# Altium project 2m_DBoard_TX.PrjPcb (part 1 of 2)
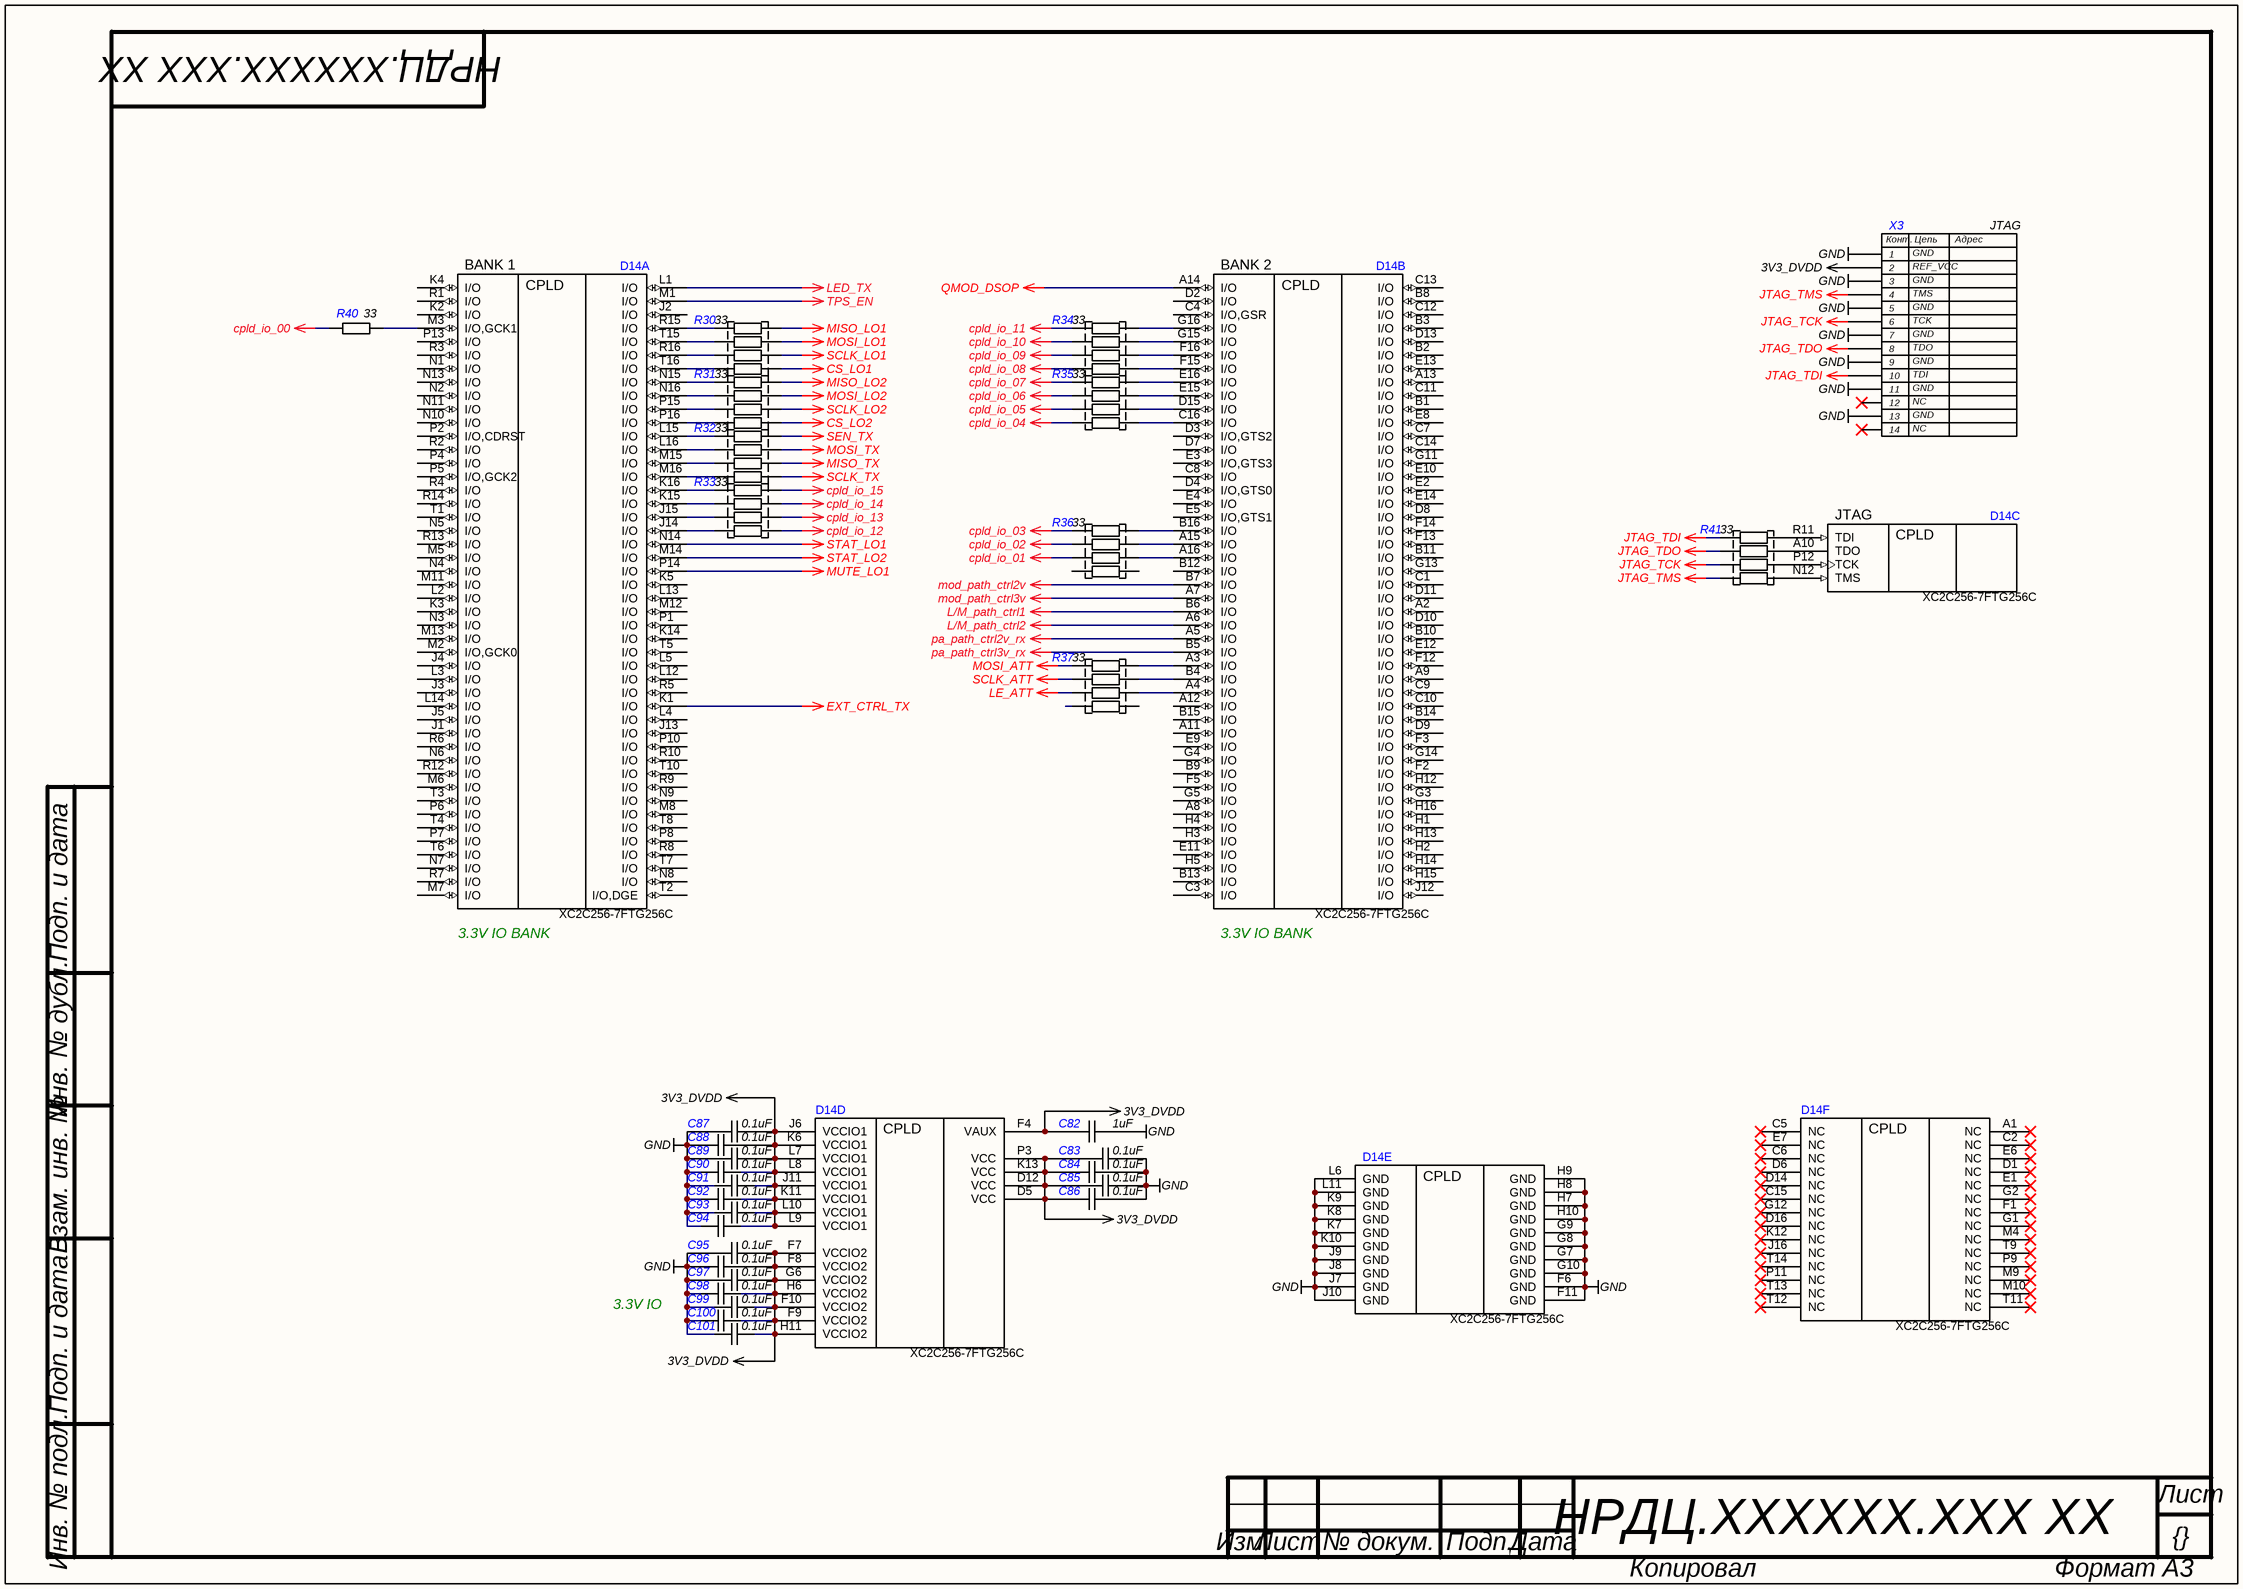
[diagram p0: CPLD.SchDoc]
7 sheets, 263 parts. Net scope: global (net labels, ports and power ports of the same name join across sheets).
Board file: 2m_DBoard_TX.PcbDoc
Sheets:
  CPLD.SchDoc
  DBoard_conn.SchDoc
  IF_TX.SchDoc
  TX.SchDoc
  REFCLK.SchDoc
  Digital.SchDoc
  Power.SchDoc

## Sheet CPLD.SchDoc: {Наименование}
size 420 x 297 mm; DocumentNumber: НРДЦ.ХХХХХХ.ХХХ ХХ; SheetNumber: {}; SheetTotal: {}; PageSetup: Record=PageOptions|CenterHorizontal=False|CenterVertical=False|PrintScale=0.95|XCorrection=0.00|YCorrection=0.00|PrintKind=1|BorderSize=5000000|LeftOffset=0|BottomOffset=0|Orientation=1|PaperLength=1000|PaperWidth=1000|Scale=100|PaperSource=15|PrintQuality=600|MediaType=1|DitherType=10|PaperKind=A4|PrintScaleMode=1; Rule: PcbType=ProtelPcb

### Parts
C82  value 1uF  [C0402]  (hidden comment: CAP)
C83  value 0.1uF  [C0402]  (hidden comment: CAP)
C84  value 0.1uF  [C0402]  (hidden comment: CAP)
C85  value 0.1uF  [C0402]  (hidden comment: CAP)
C86  value 0.1uF  [C0402]  (hidden comment: CAP)
C87  value 0.1uF  [C0402]  (hidden comment: CAP)
C88  value 0.1uF  [C0402]  (hidden comment: CAP)
C89  value 0.1uF  [C0402]  (hidden comment: CAP)
C90  value 0.1uF  [C0402]  (hidden comment: CAP)
C91  value 0.1uF  [C0402]  (hidden comment: CAP)
C92  value 0.1uF  [C0402]  (hidden comment: CAP)
C93  value 0.1uF  [C0402]  (hidden comment: CAP)
C94  value 0.1uF  [C0402]  (hidden comment: CAP)
C95  value 0.1uF  [C0402]  (hidden comment: CAP)
C96  value 0.1uF  [C0402]  (hidden comment: CAP)
C97  value 0.1uF  [C0402]  (hidden comment: CAP)
C98  value 0.1uF  [C0402]  (hidden comment: CAP)
C99  value 0.1uF  [C0402]  (hidden comment: CAP)
C100  value 0.1uF  [C0402]  (hidden comment: CAP)
C101  value 0.1uF  [C0402]  (hidden comment: CAP)
D14  XC2C256-7FTG256C  [FTG256]  (parts A,B,C,D,E,F of 6)
R30  value 33  [EXN8V]  (hidden comment: RES 4x0402)
R31  value 33  [EXN8V]  (hidden comment: RES 4x0402)
R32  value 33  [EXN8V]  (hidden comment: RES 4x0402)
R33  value 33  [EXN8V]  (hidden comment: RES 4x0402)
R34  value 33  [EXN8V]  (hidden comment: RES 4x0402)
R35  value 33  [EXN8V]  (hidden comment: RES 4x0402)
R36  value 33  [EXN8V]  (hidden comment: RES 4x0402)
R37  value 33  [EXN8V]  (hidden comment: RES 4x0402)
R40  value 33  [R0402]  (hidden comment: RES)
R41  value 33  [EXN8V]  (hidden comment: RES 4x0402)
X3  JTAG  [JTAG Mail 2mm]

### Nets
3V3_DVDD: C82.1 C83.1 C84.1 C85.1 C86.1 C87.2 C88.2 C89.2 C90.2 C91.2 C92.2 C93.2 C94.2 C95.2 C96.2 C97.2 C98.2 C99.2 C100.2 C101.2 D14.D5(VCC) D14.D12(VCC) D14.F4(VAUX) D14.F7(VCCIO2) D14.F8(VCCIO2) D14.F9(VCCIO2) D14.F10(VCCIO2) D14.G6(VCCIO2) D14.H6(VCCIO2) D14.H11(VCCIO2) D14.J6(VCCIO1) D14.J11(VCCIO1) D14.K6(VCCIO1) D14.K11(VCCIO1) D14.K13(VCC) D14.L7(VCCIO1) D14.L8(VCCIO1) D14.L9(VCCIO1) D14.L10(VCCIO1) D14.P3(VCC) X3.2
cpld_io_00: R40.2
cpld_io_01: R36.7
cpld_io_02: R36.6
cpld_io_03: R36.5
cpld_io_04: R35.8
cpld_io_05: R35.7
cpld_io_06: R35.6
cpld_io_07: R35.5
cpld_io_08: R34.8
cpld_io_09: R34.7
cpld_io_10: R34.6
cpld_io_11: R34.5
cpld_io_12: R33.8
cpld_io_13: R33.7
cpld_io_14: R33.6
cpld_io_15: R33.5
CS_LO1: R30.5
CS_LO2: R31.5
EXT_CTRL_TX: D14.K1(I/O)
GND: C82.2 C83.2 C84.2 C85.2 C86.2 C87.1 C88.1 C89.1 C90.1 C91.1 C92.1 C93.1 C94.1 C95.1 C96.1 C97.1 C98.1 C99.1 C100.1 C101.1 D14.F6(GND) D14.F11(GND) D14.G7(GND) D14.G8(GND) D14.G9(GND) D14.G10(GND) D14.H7(GND) D14.H8(GND) D14.H9(GND) D14.H10(GND) D14.J7(GND) D14.J8(GND) D14.J9(GND) D14.J10(GND) D14.K7(GND) D14.K8(GND) D14.K9(GND) D14.K10(GND) D14.L6(GND) D14.L11(GND) X3.1 X3.3 X3.5 X3.7 X3.9 X3.11 X3.13
JTAG_TCK: R41.6 X3.6
JTAG_TDI: R41.8 X3.10
JTAG_TDO: R41.7 X3.8
JTAG_TMS: R41.5 X3.4
L/M_path_ctrl1: D14.B6(I/O)
L/M_path_ctrl2: D14.A6(I/O)
LE_ATT: R37.6
LED_TX: D14.L1(I/O)
MISO_LO1: R30.8
MISO_LO2: R31.8
MISO_TX: R32.6
mod_path_ctrl2v: D14.B7(I/O)
mod_path_ctrl3v: D14.A7(I/O)
MOSI_ATT: R37.8
MOSI_LO1: R30.7
MOSI_LO2: R31.7
MOSI_TX: R32.7
MUTE_LO1: D14.P14(I/O)
pa_path_ctrl2v_rx: D14.A5(I/O)
pa_path_ctrl3v_rx: D14.B5(I/O)
QMOD_DSOP: D14.A14(I/O)
SCLK_ATT: R37.7
SCLK_LO1: R30.6
SCLK_LO2: R31.6
SCLK_TX: R32.5
SEN_TX: R32.8
STAT_LO1: D14.N14(I/O)
STAT_LO2: D14.M14(I/O)
TPS_EN: D14.M1(I/O)
NetD14_A3: D14.A3(I/O) R37.1
NetD14_A4: D14.A4(I/O) R37.3
NetD14_A10: D14.A10(TDO) R41.2
NetD14_A15: D14.A15(I/O) R36.3
NetD14_A16: D14.A16(I/O) R36.2
NetD14_B4: D14.B4(I/O) R37.2
NetD14_B16: D14.B16(I/O) R36.4
NetD14_C16: D14.C16(I/O) R35.1
NetD14_D15: D14.D15(I/O) R35.2
NetD14_E15: D14.E15(I/O) R35.3
NetD14_E16: D14.E16(I/O) R35.4
NetD14_F15: D14.F15(I/O) R34.1
NetD14_F16: D14.F16(I/O) R34.2
NetD14_G15: D14.G15(I/O) R34.3
NetD14_G16: D14.G16(I/O) R34.4
NetD14_J14: D14.J14(I/O) R33.1
NetD14_J15: D14.J15(I/O) R33.2
NetD14_K15: D14.K15(I/O) R33.3
NetD14_K16: D14.K16(I/O) R33.4
NetD14_L15: D14.L15(I/O) R32.1
NetD14_L16: D14.L16(I/O) R32.2
NetD14_M3: D14.M3(I/O,GCK1) R40.1
NetD14_M15: D14.M15(I/O) R32.3
NetD14_M16: D14.M16(I/O) R32.4
NetD14_N12: D14.N12(TMS) R41.4
NetD14_N15: D14.N15(I/O) R31.1
NetD14_N16: D14.N16(I/O) R31.2
NetD14_P12: D14.P12(TCK) R41.3
NetD14_P15: D14.P15(I/O) R31.3
NetD14_P16: D14.P16(I/O) R31.4
NetD14_R11: D14.R11(TDI) R41.1
NetD14_R15: D14.R15(I/O) R30.1
NetD14_R16: D14.R16(I/O) R30.2
NetD14_T15: D14.T15(I/O) R30.3
NetD14_T16: D14.T16(I/O) R30.4

Not connected (* = marked no-connect by the designer): D14 A1(NC)* A2(I/O) A8(I/O) A9(I/O) A11(I/O) A12(I/O) A13(I/O) B1(I/O) B2(I/O) B3(I/O) B8(I/O) B9(I/O) B10(I/O) B11(I/O) B12(I/O) B13(I/O) B14(I/O) B15(I/O) C1(I/O) C2(NC)* C3(I/O) C4(I/O,GSR) C5(NC)* C6(NC)* C7(I/O) C8(I/O) C9(I/O) C10(I/O) C11(I/O) C12(I/O) C13(I/O) C14(I/O) C15(NC)* D1(NC)* D2(I/O) D3(I/O,GTS2) D4(I/O,GTS0) D6(NC)* D7(I/O) D8(I/O) D9(I/O) D10(I/O) D11(I/O) D13(I/O) D14(NC)* D16(NC)* E1(NC)* E2(I/O) E3(I/O,GTS3) E4(I/O) E5(I/O,GTS1) E6(NC)* E7(NC)* E8(I/O) E9(I/O) E10(I/O) E11(I/O) E12(I/O) E13(I/O) E14(I/O) F1(NC)* F2(I/O) F3(I/O) F5(I/O) F12(I/O) F13(I/O) F14(I/O) G1(NC)* G2(NC)* G3(I/O) G4(I/O) G5(I/O) G11(I/O) G12(NC)* G13(I/O) G14(I/O) H1(I/O) H2(I/O) H3(I/O) H4(I/O) H5(I/O) H12(I/O) H13(I/O) H14(I/O) H15(I/O) H16(I/O) J1(I/O) J2(I/O) J3(I/O) J4(I/O) J5(I/O) J12(I/O) J13(I/O) J16(NC)* K2(I/O) K3(I/O) K4(I/O) K5(I/O) K12(NC)* K14(I/O) L2(I/O) L3(I/O) L4(I/O) L5(I/O) L12(I/O) L13(I/O) L14(I/O) M2(I/O,GCK0) M4(NC)* M5(I/O) M6(I/O) M7(I/O) M8(I/O) M9(NC)* M10(NC)* M11(I/O) M12(I/O) M13(I/O) N1(I/O) N2(I/O) N3(I/O) N4(I/O) N5(I/O) N6(I/O) N7(I/O) N8(I/O) N9(I/O) N10(I/O) N11(I/O) N13(I/O) P1(I/O) P2(I/O,CDRST) P4(I/O) P5(I/O,GCK2) P6(I/O) P7(I/O) P8(I/O) P9(NC)* P10(I/O) P11(NC)* P13(I/O) R1(I/O) R2(I/O) R3(I/O) R4(I/O) R5(I/O) R6(I/O) R7(I/O) R8(I/O) R9(I/O) R10(I/O) R12(I/O) R13(I/O) R14(I/O) T1(I/O) T2(I/O,DGE) T3(I/O) T4(I/O) T5(I/O) T6(I/O) T7(I/O) T8(I/O) T9(NC)* T10(I/O) T11(NC)* T12(NC)* T13(NC)* T14(NC)*; R36 1 8; R37 4 5; X3 12* 14*

### Notes on the sheet
- (near X3) GND
- (near X3) REF_VCC
- (near X3) TMS
- (near X3) TCK
- (near X3) TDO
- (near X3) TDI
- (near X3) NC
- (near D14) 3.3V IO BANK
- 3.3V IO
- Подп. и дата
- Инв. № дубл.
- Взам. инв. №
- Инв. № подл.
- Лист
- Изм.
- № докум.
- Подп.
- Дата
- Копировал
- Формат А3
- (in symbol HDR Debug_14-pin) Конт.; Цепь; Адрес
- (in symbol XC2C256-7FTG256C, part A) BANK 1
- (in symbol XC2C256-7FTG256C, part B) BANK 2
- (in symbol XC2C256-7FTG256C, part C) JTAG

### Library data of the parts
C82 = CAP: SMD Capacitor; Manufacturer: Murata; Material: X7R; Tolerance: 10%; Voltage: 6.3V; Type: Ceramic Capacitor; P/N: GRM155R70J105KA12J; Supplier 1: Digi-key; Supplier Part Number 1: 490-13339-1-ND; Supplier 2: Mouser; Supplier Part Number 2: 81-GRM155R70J105KA2J; Supplier 3: Farnell; Supplier Part Number 3: *
C83-C101 = CAP: SMD Capacitor; Manufacturer: Murata; Material: X7R; Tolerance: 10%; Voltage: 10V; Type: Ceramic Capacitor; P/N: GRM155R71A104KA01J; Supplier 1: Digi-key; Supplier Part Number 1: 490-6322-1-ND; Supplier 2: Mouser; Supplier Part Number 2: 81-GRM155R71A104KA1J; Supplier 3: Farnell; Supplier Part Number 3: *
D14 = XC2C256-7FTG256C: CoolRunner-II 1.8V, 256 Macrocell CPLD, 184 User I/Os, 256-Ball FTBGA, Commercial Grade, Pb-Free; Code_JEDEC: MS-034-AAF-1*; PackageVersion: ver1.3, Oct-2007; PackageReference: FTG256; PackageDescription: 256-Ball Fine Pitch Thin Ball Grid Array 1.00 mm Pitch (FTG256) - Pb-Free; DatasheetVersion: ver3.2, Mar-2007; PartNumber: XC2C256-7FTG256C; P/N: XC2C256-7FTG256C; Name: XC2C256-7FTG256C; Type: CPLD; Supplier 1: Digi-key; Supplier Part Number 1: 122-1400-ND; Supplier 2: Mouser; Supplier Part Number 2: 217-XC2C256-7FTG256C; Supplier 3: Farnell; Supplier Part Number 3: *
R30-R37 R41 = RES 4x0402: Chip Resistor Array; Manufacturer: Panasonic; Name: EXBN8V; Number of Resistors: 4; Tolerance: 5%; P/N: ERJ-2GEJ330X; Type: 0402 Array Concave Terminal; Number of Terminals: 8; Series: EXB; Supplier 1: Digi-key; Supplier Part Number 1: Y10330CT-ND; Supplier 2: Mouser; Supplier Part Number 2: 667-EXB-N8V330JX; Supplier 3: Farnell; Supplier Part Number 3: *; Supplier 4: Digi-key; Supplier Part Number 4: *; Supplier 5: Mouser; Supplier Part Number 5: *; Supplier 6: Farnell; Supplier Part Number 6: *
R40 = RES: SMD Resistor; Name: Chip SMD Resistor; Power: 0.1 Wt; Tolerance: 1%; P/N: ERJ-2RKF33R0X; Temperature Range: -55…155°C; Supplier 1: Digi-key; Supplier Part Number 1: P33.0LCT-ND; Supplier 2: Mouser; Supplier Part Number 2: 667-ERJ-2RKF33R0X; Supplier 3: Farnell; Supplier Part Number 3: *
X3 = HDR Debug_14-pin: 2.00mm Pitch, Milli-Grid PCB Header, Dual Row, Vertical, Through Hole, Shrouded, 14 / Circuits; Manufacturer: Molex; Name: Milli-Grid Connector System; P/N: 878311421; Type: 2.00mm Pitch, Milli-Grid PCB Header, Dual Row, Vertical, Through Hole, Shrouded, 14; Series: 87831; Supplier 1: Digi-key; Supplier Part Number 1: WM4224-ND; Supplier 2: Mouser; Supplier Part Number 2: 538-87831-1421; Supplier 3: Farnell; Supplier Part Number 3: *

## Sheet DBoard_conn.SchDoc: {Наименование}
size 420 x 297 mm; DocumentNumber: ПЛАС.ХХХХХХ.ХХХ ХХ; SheetNumber: {}; SheetTotal: {}; PageSetup: Record=PageOptions|CenterHorizontal=False|CenterVertical=False|PrintScale=0.95|XCorrection=0.00|YCorrection=0.00|PrintKind=1|BorderSize=5000000|LeftOffset=0|BottomOffset=0|Orientation=1|PaperLength=1000|PaperWidth=1000|Scale=100|PaperSource=15|PrintQuality=600|MediaType=1|DitherType=10|PaperKind=A4|PrintScaleMode=1; Rule: PcbType=ProtelPcb
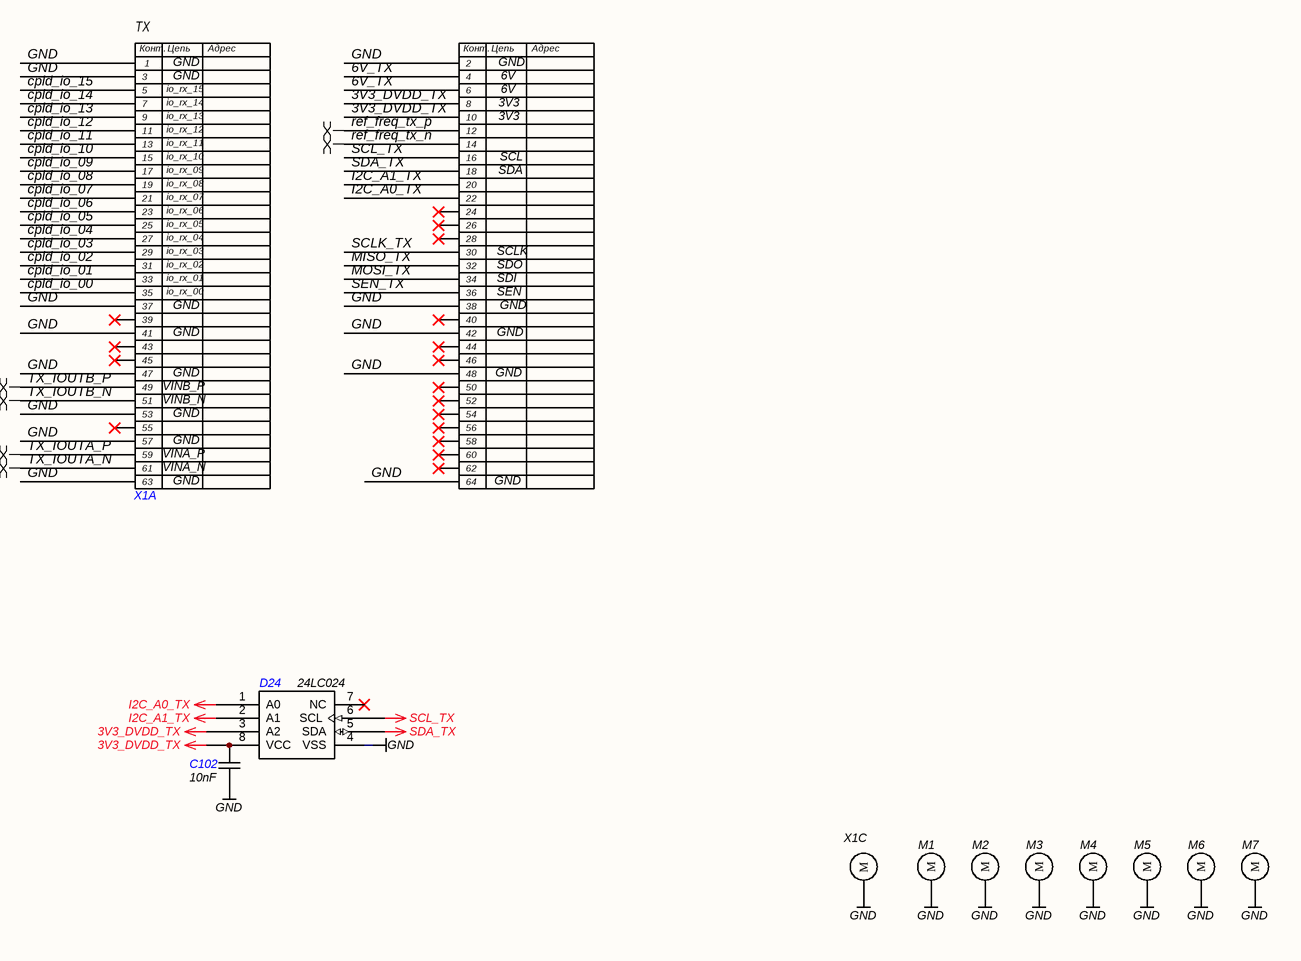
[diagram p1: DBoard_conn.SchDoc]

### Parts
C102  value 10nF  [C0402]  (hidden comment: CAP)
D24  24LC024  [SOIC_SN8]
M1  Via  [Mechanical_Via_2.6x4.2]  (value not drawn)
M2  Via  [Mechanical_Via_2.6x4.2]  (value not drawn)
M3  Via  [Mechanical_Via_2.6x4.2]  (value not drawn)
M4  Via  [Mechanical_Via_2.6x4.2]  (value not drawn)
M5  Via  [Mechanical_Via_2.6x4.2]  (value not drawn)
M6  Via  [Mechanical_Via_2.6x4.2]  (value not drawn)
M7  Via  [Mechanical_Via_2.6x4.2]  (value not drawn)
X1  DBoard  [DBOARD-HALF-TX-MB]  (value not drawn)  (parts A,C of 3)

### Nets
3V3_DVDD_TX: C102.2 D24.3(A2) D24.8(VCC) X1.8 X1.10
6V_TX: X1.4 X1.6
cpld_io_00: X1.35
cpld_io_01: X1.33
cpld_io_02: X1.31
cpld_io_03: X1.29
cpld_io_04: X1.27
cpld_io_05: X1.25
cpld_io_06: X1.23
cpld_io_07: X1.21
cpld_io_08: X1.19
cpld_io_09: X1.17
cpld_io_10: X1.15
cpld_io_11: X1.13
cpld_io_12: X1.11
cpld_io_13: X1.9
cpld_io_14: X1.7
cpld_io_15: X1.5
GND: C102.1 D24.4(VSS) M1.0(M) M2.0(M) M3.0(M) M4.0(M) M5.0(M) M6.0(M) M7.0(M) X1.0(M) X1.1 X1.2 X1.3 X1.37 X1.38 X1.41 X1.42 X1.47 X1.48 X1.53 X1.57 X1.63 X1.64
I2C_A0_TX: D24.1(A0) X1.22
I2C_A1_TX: D24.2(A1) X1.20
MISO_TX: X1.32
MOSI_TX: X1.34
ref_freq_tx_n: X1.14
ref_freq_tx_p: X1.12
SCL_TX: D24.6(SCL) X1.16
SCLK_TX: X1.30
SDA_TX: D24.5(SDA) X1.18
SEN_TX: X1.36
TX_IOUTA_N: X1.61
TX_IOUTA_P: X1.59
TX_IOUTB_N: X1.51
TX_IOUTB_P: X1.49

Not connected (* = marked no-connect by the designer): D24 7(NC)*; X1 24* 26* 28* 39* 40* 43* 44* 45* 46* 50* 52* 54* 55* 56* 58* 60* 62*

### Layout directives
differential pair: ref_freq_tx_n, ref_freq_tx_p, TX_IOUTA_N, TX_IOUTA_P, TX_IOUTB_N, TX_IOUTB_P

### Notes on the sheet
- (near X1) io_rx_15
- (near X1) io_rx_14
- (near X1) GND
- (near X1) 3V3
- (near X1) 6V
- (near X1) io_rx_13
- (near X1) io_rx_12
- (near X1) io_rx_11
- (near X1) io_rx_10
- (near X1) io_rx_09
- (near X1) SDA
- (near X1) SCL
- (near X1) io_rx_08
- (near X1) io_rx_07
- (near X1) io_rx_06
- (near X1) io_rx_05
- (near X1) io_rx_04
- (near X1) io_rx_03
- (near X1) io_rx_02
- (near X1) io_rx_01
- (near X1) io_rx_00
- (near X1) SCLK
- (near X1) SDO
- (near X1) SDI
- (near X1) SEN
- (near X1) VINB_P
- (near X1) VINB_N
- (near X1) VINA_P
- (near X1) VINA_N
- Подп. и дата
- Инв. № дубл.
- Взам. инв. №
- Инв. № подл.
- Лист
- Изм.
- № докум.
- Подп.
- Дата
- Копировал
- Формат А3
- (in symbol DBoard, part A) TX; Конт.; Цепь; Адрес

### Library data of the parts
C102 = CAP: SMD Capacitor; Manufacturer: Murata; Material: X7R; Tolerance: 10%; Voltage: 25V; Type: Ceramic Capacitor; P/N: GRM155R71E103KA01D; Supplier 1: Digi-key; Supplier Part Number 1: 490-1312-1-ND; Supplier 2: Mouser; Supplier Part Number 2: 81-GRM36X103K25; Supplier 3: Farnell; Supplier Part Number 3: *
D24 = 24LC024: I2C EEPROM; Manufacturer: Microchip; Capacity: 2kbit; Max Clock: 400 kHz; Voltage: 2.5-5.5V; P/N: 24LC024HT-I/SN; Name: 24LC024; Package: SOIC-8; Type: I2C EEPROM; Value: 24LC024; Supplier 1: Digi-key; Supplier Part Number 1: 24LC024HT-I/SNCT-ND; Supplier 2: Mouser; Supplier Part Number 2: 579-24LC024HT-I/SN; Supplier 3: Farnell; Supplier Part Number 3: *
M1-M7 = Mechanical Via: Supplier 4: Digi-key; Supplier Part Number 4: *; Supplier 5: Mouser; Supplier Part Number 5: *; Supplier 6: Farnell; Supplier Part Number 6: *
X1 = DBoard: USRP DBoard; Manufacturer: Molex; Name: 1.00mm Pitch Mezzanine 714390164; P/N: 714390164; Supplier 1: Digi-Key; Supplier Part Number 1: WM17201-ND; Supplier 2: Mouser; Supplier Part Number 2: 538-71439-0164; Supplier 3: Farnell; Supplier Part Number 3: *

## Sheet IF_TX.SchDoc: {Наименование}
size 420 x 297 mm; DocumentNumber: ПЛАС.ХХХХХХ.ХХХ ХХ; SheetNumber: {}; SheetTotal: {}; PageSetup: Record=PageOptions|CenterHorizontal=False|CenterVertical=False|PrintScale=0.95|XCorrection=0.00|YCorrection=0.00|PrintKind=1|BorderSize=5000000|LeftOffset=0|BottomOffset=0|Orientation=1|PaperLength=1000|PaperWidth=1000|Scale=100|PaperSource=15|PrintQuality=600|MediaType=1|DitherType=10|PaperKind=A4|PrintScaleMode=1; Rule: PcbType=ProtelPcb
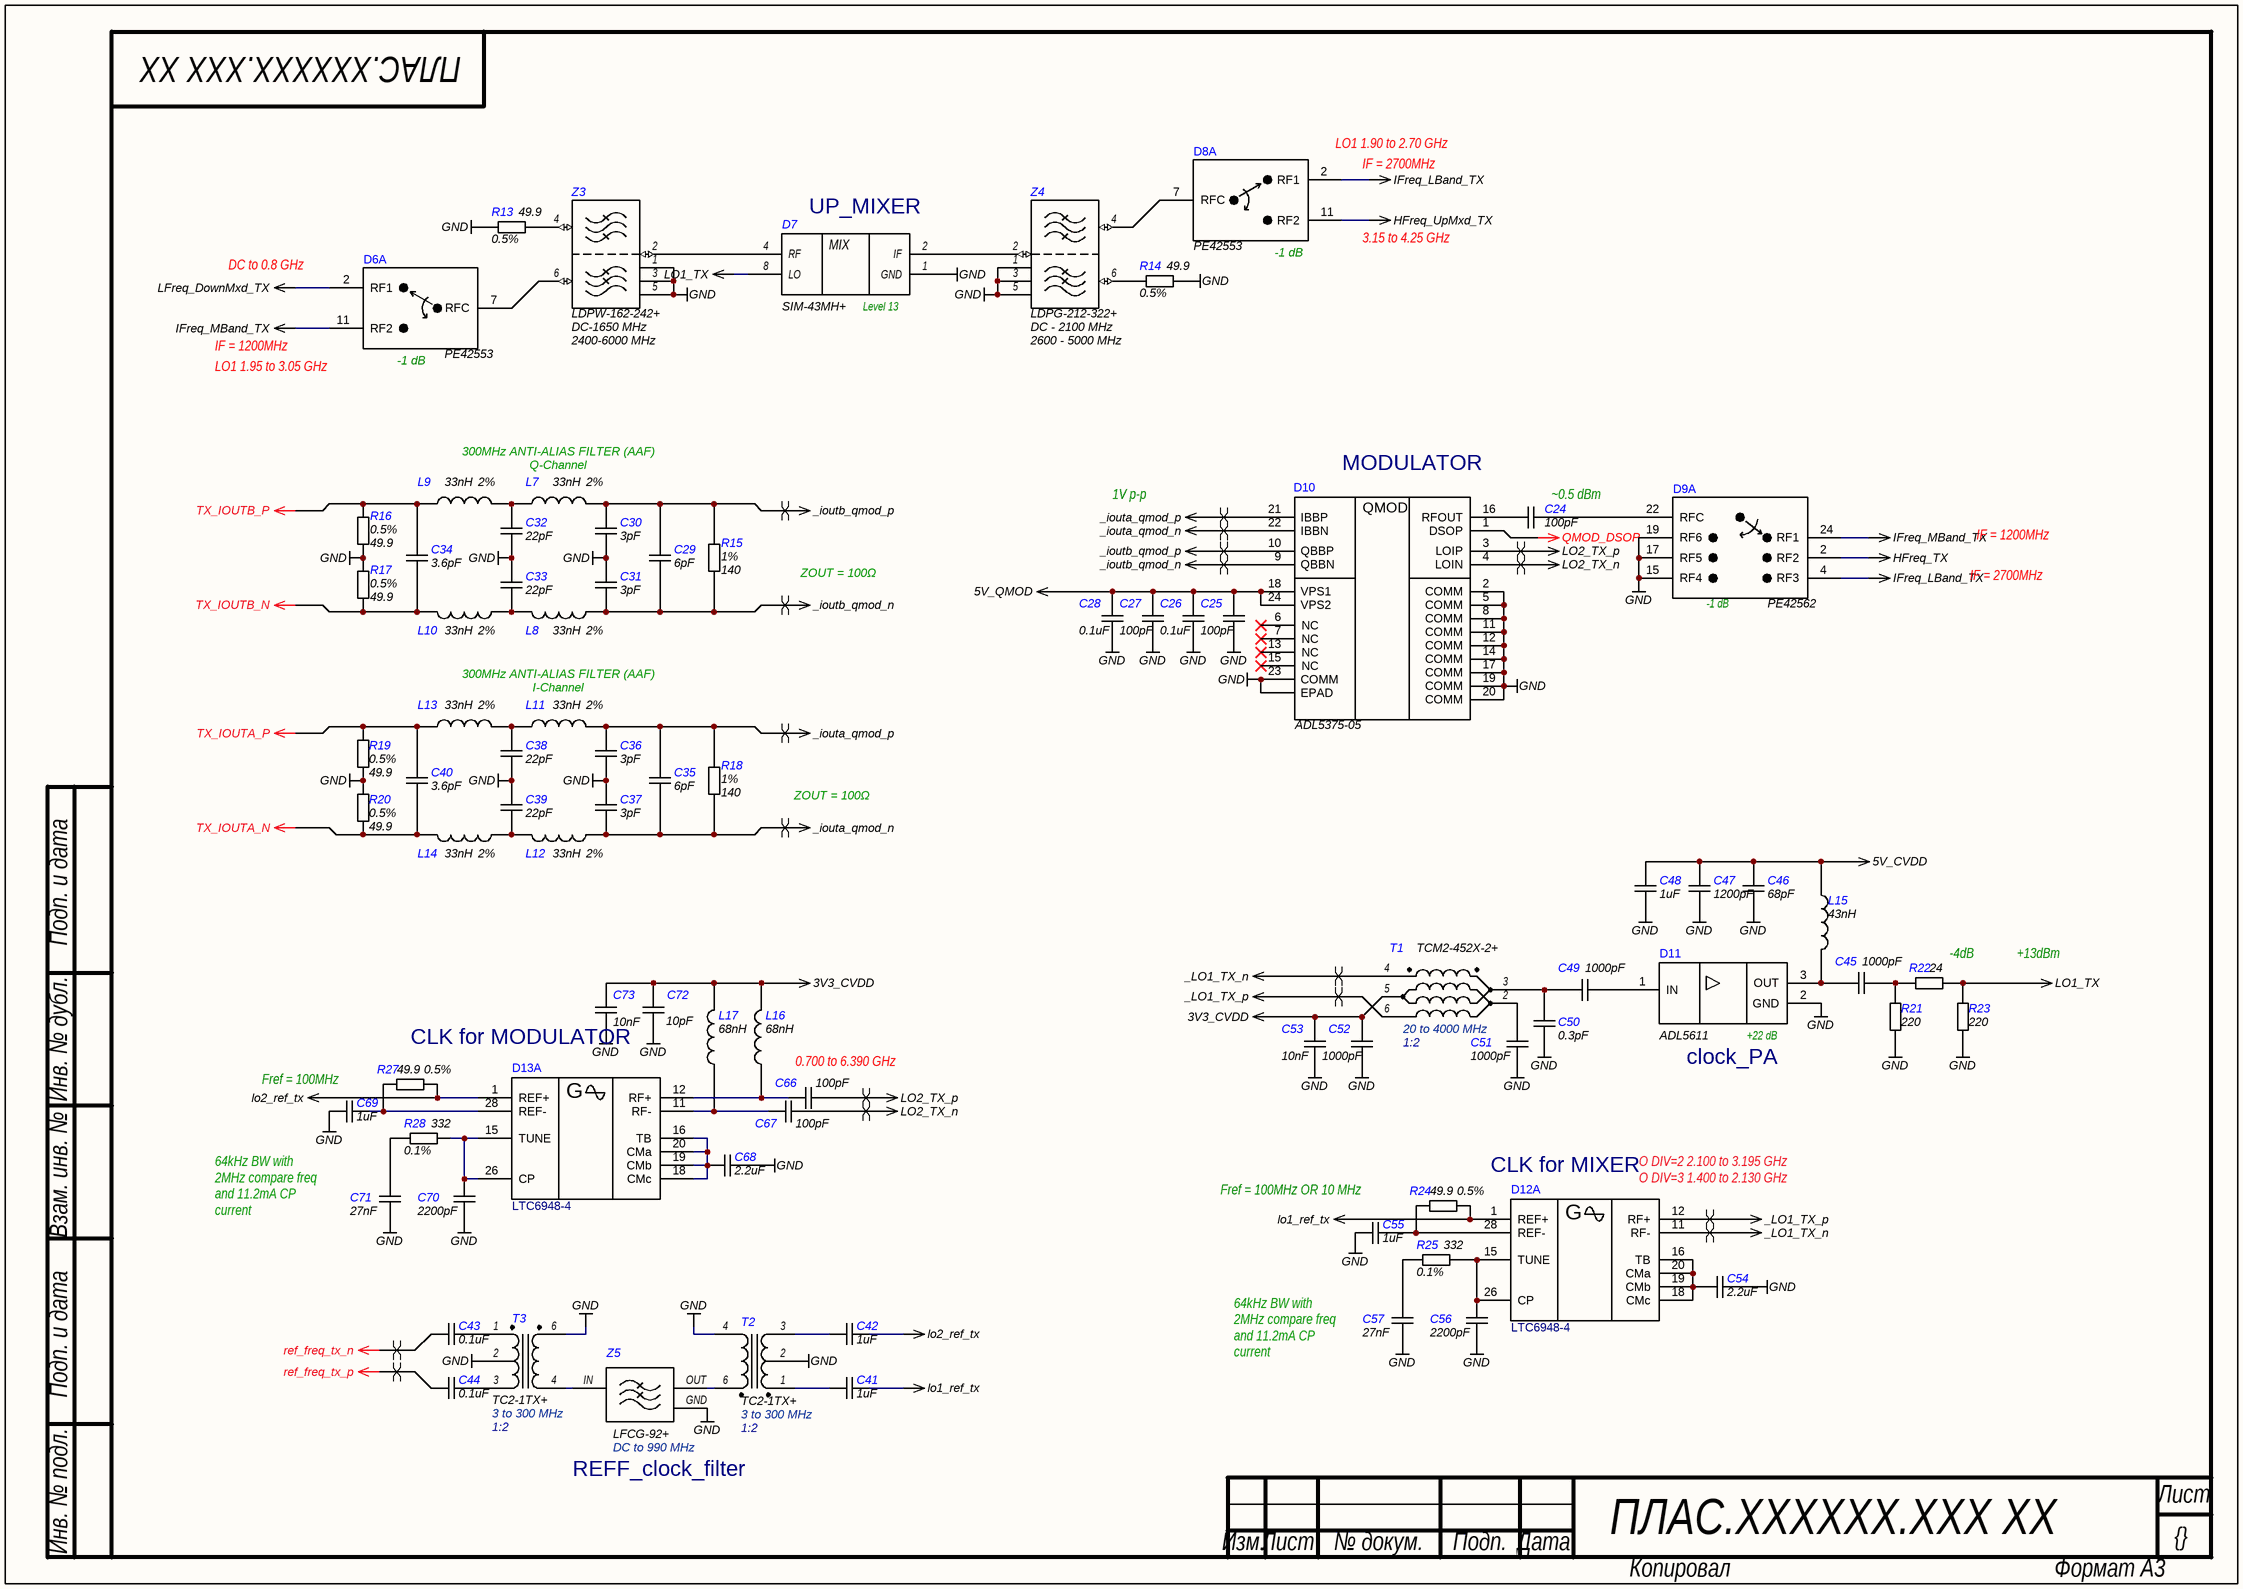
[diagram p2: IF_TX.SchDoc]

### Parts
C24  value 100pF  [C0402]  (hidden comment: CAP)
C25  value 100pF  [C0402]  (hidden comment: CAP)
C26  value 0.1uF  [C0402]  (hidden comment: CAP)
C27  value 100pF  [C0402]  (hidden comment: CAP)
C28  value 0.1uF  [C0402]  (hidden comment: CAP)
C29  value 6pF  [C0402]  (hidden comment: CAP)
C30  value 3pF  [C0402]  (hidden comment: CAP)
C31  value 3pF  [C0402]  (hidden comment: CAP)
C32  value 22pF  [C0402]  (hidden comment: CAP)
C33  value 22pF  [C0402]  (hidden comment: CAP)
C34  value 3.6pF  [C0402]  (hidden comment: CAP)
C35  value 6pF  [C0402]  (hidden comment: CAP)
C36  value 3pF  [C0402]  (hidden comment: CAP)
C37  value 3pF  [C0402]  (hidden comment: CAP)
C38  value 22pF  [C0402]  (hidden comment: CAP)
C39  value 22pF  [C0402]  (hidden comment: CAP)
C40  value 3.6pF  [C0402]  (hidden comment: CAP)
C41  value 1uF  [C0603]  (hidden comment: CAP)
C42  value 1uF  [C0603]  (hidden comment: CAP)
C43  value 0.1uF  [C0402]  (hidden comment: CAP)
C44  value 0.1uF  [C0402]  (hidden comment: CAP)
C45  value 1000pF  [C0402]  (hidden comment: CAP)
C46  value 68pF  [C0402]  (hidden comment: CAP)
C47  value 1200pF  [C0603]  (hidden comment: CAP)
C48  value 1uF  [C0603]  (hidden comment: CAP)
C49  value 1000pF  [C0402]  (hidden comment: CAP)
C50  value 0.3pF  [C0402]  (hidden comment: CAP)
C51  value 1000pF  [C0402]  (hidden comment: CAP)
C52  value 1000pF  [C0402]  (hidden comment: CAP)
C53  value 10nF  [C0402]  (hidden comment: CAP)
C54  value 2.2uF  [C0603]  (hidden comment: CAP)
C55  value 1uF  [C0603]  (hidden comment: CAP)
C56  value 2200pF  [C0603]  (hidden comment: CAP)
C57  value 27nF  [C0603]  (hidden comment: CAP)
C66  value 100pF  [C0402]  (hidden comment: CAP)
C67  value 100pF  [C0402]  (hidden comment: CAP)
C68  value 2.2uF  [C0603]  (hidden comment: CAP)
C69  value 1uF  [C0603]  (hidden comment: CAP)
C70  value 2200pF  [C0603]  (hidden comment: CAP)
C71  value 27nF  [C0603]  (hidden comment: CAP)
C72  value 10pF  [C0402]  (hidden comment: CAP)
C73  value 10nF  [C0402]  (hidden comment: CAP)
D6  PE42553  [QFN-16]  (part A of 2)
D7  SIM-43MH+  [SIM-43MH+]
D8  PE42553  [QFN-16]  (part A of 2)
D9  PE42562  [QFN-24]  (part A of 2)
D10  Name: ADL5375-05  [LFCSP-24]  (hidden comment: ADL5375)
D11  ADL5611  [ADL5610]
D12  LTC6948-4  [QFN-28]  (part A of 2)
D13  LTC6948-4  [QFN-28]  (part A of 2)
L7  value 33nH  Tolerance: 2%  [L0603_HP]  (hidden comment: Inductor RF)
L8  value 33nH  Tolerance: 2%  [L0603_HP]  (hidden comment: Inductor RF)
L9  value 33nH  Tolerance: 2%  [L0603_HP]  (hidden comment: Inductor RF)
L10  value 33nH  Tolerance: 2%  [L0603_HP]  (hidden comment: Inductor RF)
L11  value 33nH  Tolerance: 2%  [L0603_HP]  (hidden comment: Inductor RF)
L12  value 33nH  Tolerance: 2%  [L0603_HP]  (hidden comment: Inductor RF)
L13  value 33nH  Tolerance: 2%  [L0603_HP]  (hidden comment: Inductor RF)
L14  value 33nH  Tolerance: 2%  [L0603_HP]  (hidden comment: Inductor RF)
L15  value 43nH  [L0603_HP]  (hidden comment: Inductor RF)
L16  value 68nH  [L0603_HP]  (hidden comment: Inductor RF)
L17  value 68nH  [L0603_HP]  (hidden comment: Inductor RF)
R13  value 49.9  Tolerance: 0.5%  [R0402]  (hidden comment: RES)
R14  value 49.9  Tolerance: 0.5%  [R0402]  (hidden comment: RES)
R15  value 140  Tolerance: 1%  [R0402]  (hidden comment: RES)
R16  value 49.9  Tolerance: 0.5%  [R0402]  (hidden comment: RES)
R17  value 49.9  Tolerance: 0.5%  [R0402]  (hidden comment: RES)
R18  value 140  Tolerance: 1%  [R0402]  (hidden comment: RES)
R19  value 49.9  Tolerance: 0.5%  [R0402]  (hidden comment: RES)
R20  value 49.9  Tolerance: 0.5%  [R0402]  (hidden comment: RES)
R21  value 220  [R0402]  (hidden comment: RES)
R22  value 24  [R0402]  (hidden comment: RES)
R23  value 220  [R0402]  (hidden comment: RES)
R24  value 49.9  Tolerance: 0.5%  [R0402]  (hidden comment: RES)
R25  value 332  Tolerance: 0.1%  [R0603]  (hidden comment: RES)
R27  value 49.9  Tolerance: 0.5%  [R0402]  (hidden comment: RES)
R28  value 332  Tolerance: 0.1%  [R0603]  (hidden comment: RES)
T1  TCM2-452X-2+  Frequency: 20 to 4000 MHz  Ratio: 1:2  [DB1627]
T2  TC2-1TX+  Frequency: 3 to 300 MHz  Ratio: 1:2  [AT1521]
T3  TC2-1TX+  Frequency: 3 to 300 MHz  Ratio: 1:2  [AT1521]
Z3  LDPW-162-242+  Low Pass: DC-1650 MHz  High Pass: 2400-6000 MHz  [JC0603C]
Z4  LDPG-212-322+  Low Pass: DC - 2100 MHz  High Pass: 2600 - 5000 MHz  [GE0805C-10]
Z5  LFCG-92+  Frequency: DC to 990 MHz  [GE0805C-2]

### Nets
3V3_CVDD: C52.1 C53.2 C72.2 C73.2 L16.2 L17.2 T1.5
5V_CVDD: C46.2 C47.2 C48.1 L15.2
5V_QMOD: C25.2 C26.2 C27.2 C28.2 D10.18(VPS1) D10.24(VPS2)
_iouta_qmod_n: C35.2 C37.2 D10.22(IBBN) L12.2 R18.2
_iouta_qmod_p: C35.1 C36.1 D10.21(IBBP) L11.2 R18.1
_ioutb_qmod_n: C29.2 C31.2 D10.9(QBBN) L8.2 R15.2
_ioutb_qmod_p: C29.1 C30.1 D10.10(QBBP) L7.2 R15.1
_LO1_TX_n: D12.11(RF-) T1.4
_LO1_TX_p: D12.12(RF+) T1.6
GND: C25.1 C26.1 C27.1 C28.1 C30.2 C31.1 C32.2 C33.1 C36.2 C37.1 C38.2 C39.1 C46.1 C47.1 C48.2 C50.1 C51.2 C52.2 C53.1 C54.1 C55.2 C56.1 C57.1 C68.1 C69.2 C70.1 C71.1 C72.1 C73.1 D7.1(GND) D9.15(RF4) D9.17(RF5) D9.19(RF6) D10.2(COMM) D10.5(COMM) D10.8(COMM) D10.11(COMM) D10.12(COMM) D10.14(COMM) D10.17(COMM) D10.19(COMM) D10.20(COMM) D10.23(COMM) D10.25(EPAD) D11.2(GND) R13.1 R14.1 R16.2 R17.1 R19.2 R20.1 R21.2 R23.2 T2.2 T2.4 T3.2 T3.6 Z3.1(GND) Z3.3(GND) Z3.5(GND) Z4.1(GND) Z4.3(GND) Z4.5(GND) Z5.GND
HFreq_TX: D9.2(RF2)
HFreq_UpMxd_TX: D8.11(RF2)
IFreq_LBand_TX: D8.2(RF1) D9.4(RF3)
IFreq_MBand_TX: D6.11(RF2) D9.24(RF1)
LFreq_DownMxd_TX: D6.2(RF1)
lo1_ref_tx: C41.1 D12.1(REF+) R24.1
LO1_TX: D7.8(LO) R22.1 R23.1
lo2_ref_tx: C42.1 D13.1(REF+) R27.1
LO2_TX_n: C67.2 D10.4(LOIN)
LO2_TX_p: C66.2 D10.3(LOIP)
QMOD_DSOP: D10.1(DSOP)
ref_freq_tx_n: C43.2
ref_freq_tx_p: C44.2
TX_IOUTA_N: C40.2 L14.1 R20.2
TX_IOUTA_P: C40.1 L13.1 R19.1
TX_IOUTB_N: C34.2 L10.1 R17.2
TX_IOUTB_P: C34.1 L9.1 R16.1
NetC24_1: C24.1 D10.16(RFOUT)
NetC24_2: C24.2 D9.22(RFC)
NetC32_1: C32.1 L7.1 L9.2
NetC33_2: C33.2 L8.1 L10.2
NetC38_1: C38.1 L11.1 L13.2
NetC39_2: C39.2 L12.1 L14.2
NetC41_2: C41.2 T2.1
NetC42_2: C42.2 T2.3
NetC43_1: C43.1 T3.1
NetC44_1: C44.1 T3.3
NetC45_1: C45.1 D11.3(OUT) L15.1
NetC45_2: C45.2 R21.1 R22.2
NetC49_1: C49.1 C50.2 T1.3
NetC49_2: C49.2 D11.1(IN)
NetC51_1: C51.1 T1.2
NetC54_2: C54.2 D12.16(TB) D12.18(CMc) D12.19(CMb) D12.20(CMa)
NetC55_1: C55.1 D12.28(REF-) R24.2
NetC56_2: C56.2 D12.15(TUNE) D12.26(CP) R25.1
NetC57_2: C57.2 R25.2
NetC66_1: C66.1 D13.12(RF+) L16.1
NetC67_1: C67.1 D13.11(RF-) L17.1
NetC68_2: C68.2 D13.16(TB) D13.18(CMc) D13.19(CMb) D13.20(CMa)
NetC69_1: C69.1 D13.28(REF-) R27.2
NetC70_2: C70.2 D13.15(TUNE) D13.26(CP) R28.1
NetC71_2: C71.2 R28.2
NetD6_7: D6.7(RFC) Z3.6
NetD7_2: D7.2(IF) Z4.2
NetD7_4: D7.4(RF) Z3.2
NetD8_7: D8.7(RFC) Z4.4
NetR13_2: R13.2 Z3.4
NetR14_2: R14.2 Z4.6
NetT2_6: T2.6 Z5.OUT
NetT3_4: T3.4 Z5.IN

Not connected (* = marked no-connect by the designer): D10 6(NC)* 7(NC)* 13(NC)* 15(NC)*

### Layout directives
differential pair: _iouta_qmod_n, _iouta_qmod_p, _ioutb_qmod_n, _ioutb_qmod_p, _LO1_TX_n, _LO1_TX_p, LO2_TX_n, LO2_TX_p, ref_freq_tx_n, ref_freq_tx_p

### Notes on the sheet
- (near D8) LO1 1.90 to 2.70 GHz
- IF = 2700MHz
- (near D7) UP_MIXER
- 3.15 to 4.25 GHz
- (near D6) DC to 0.8 GHz
- IF = 1200MHz
- (near D6) LO1 1.95 to 3.05 GHz
- 300MHz ANTI-ALIAS FILTER (AAF) Q-Channel
- 1V p-p
- (near D10) MODULATOR
- (near C24) ~0.5 dBm
- ZOUT = 100Ω
- 300MHz ANTI-ALIAS FILTER (AAF) I-Channel
- (near R22) -4dB
- +13dBm
- (near C73) CLK for MODULATOR
- 0.700 to 6.390 GHz
- (near D11) clock_PA
- (near C69) Fref = 100MHz
- Fref = 100MHz OR 10 MHz
- CLK for MIXER
- (near D12) O DIV=2 2.100 to 3.195 GHz
  O DIV=3 1.400 to 2.130 GHz
- 64kHz BW with 2MHz compare freq and 11.2mA CP current
- REFF_clock_filter
- Подп. и дата
- Инв. № дубл.
- Взам. инв. №
- Инв. № подл.
- Лист
- Изм.
- № докум.
- Подп.
- Дата
- Копировал
- Формат А3
- (in symbol ADL5375) QMOD
- (in symbol ADL5611) +22 dB
- (in symbol LTC6948, part A) G
- (in symbol PE42553, part A) -1 dB
- (in symbol PE42562, part A) -1 dB
- (in symbol SIM-43MH+) MIX; Level 13

### Library data of the parts
C24 C25 C27 C66 C67 = CAP: SMD Capacitor; Manufacturer: Murata; Material: NP0; Tolerance: 1%; Voltage: 50V; Type: Ceramic Capacitor; P/N: GRM1555C1H101FA01D; Supplier 1: Digi-key; Supplier Part Number 1: 490-8180-1-ND; Supplier 2: Mouser; Supplier Part Number 2: 81-GRM1555C1H101FA1D; Supplier 3: Farnell; Supplier Part Number 3: *
C26 C28 C43 C44 = CAP: as C83 on sheet CPLD; Supplier 1: Digi-key; Supplier Part Number 1: 490-6322-1-ND; Supplier 2: Mouser; Supplier Part Number 2: 81-GRM155R71A104KA1J; Supplier 3: Farnell; Supplier Part Number 3: *
C29 C35 = CAP: SMD Capacitor; Manufacturer: Murata; Material: NP0; Tolerance: ±0.5pF; Voltage: 50V; Type: Ceramic Capacitor; P/N: GRM1555C1H6R0DA01D; Supplier 1: Digi-key; Supplier Part Number 1: 490-5877-1-ND; Supplier 2: Mouser; Supplier Part Number 2: 81-GRM1555C1H6R0DA1D; Supplier 3: Farnell; Supplier Part Number 3: *
C30 C31 C36 C37 = CAP: SMD Capacitor; Manufacturer: Murata; Material: NP0; Tolerance: ±0.25pF; Voltage: 50V; Type: Ceramic Capacitor; P/N: GRM1555C1H3R0CA01D; Supplier 1: Digi-key; Supplier Part Number 1: 490-5872-1-ND; Supplier 2: Mouser; Supplier Part Number 2: 81-GRM1555C1H3R0CA1D; Supplier 3: Farnell; Supplier Part Number 3: *
C32 C33 C38 C39 = CAP: SMD Capacitor; Manufacturer: Murata; Material: NP0; Tolerance: 1%; Voltage: 50V; Type: Ceramic Capacitor; P/N: GRM1555C1H220FA01D; Supplier 1: Digi-key; Supplier Part Number 1: 490-8589-1-ND; Supplier 2: Mouser; Supplier Part Number 2: 81-GRM1555C1H220FA1D; Supplier 3: Farnell; Supplier Part Number 3: *
C34 C40 = CAP: SMD Capacitor; Manufacturer: Murata; Material: NP0; Tolerance: ±0.25pF; Voltage: 50V; Type: Ceramic Capacitor; P/N: GRM1555C1H3R6CA01D; Supplier 1: Digi-key; Supplier Part Number 1: 490-5939-1-ND; Supplier 2: Mouser; Supplier Part Number 2: 81-GRM1555C1H3R6CA1D; Supplier 3: Farnell; Supplier Part Number 3: *
C41 C42 C48 C55 C69 = CAP: SMD Capacitor; Manufacturer: Kemet; Material: X7R; Tolerance: 10%; Voltage: 16V; Type: Ceramic Capacitor; P/N: C0603C105K4RACTU; Supplier 1: Digi-key; Supplier Part Number 1: 399-C0603C105K4RAC7867CT-ND; Supplier 2: Mouser; Supplier Part Number 2: 80-C0603C105K4R; Supplier 3: Farnell; Supplier Part Number 3: *
C45 C49 C51 C52 = CAP: SMD Capacitor; Manufacturer: Murata; Material: NP0; Tolerance: 5%; Voltage: 50V; Type: Ceramic Capacitor; P/N: GRM1555C1H102JA01D; Supplier 1: Digi-key; Supplier Part Number 1: 490-3244-1-ND; Supplier 2: Mouser; Supplier Part Number 2: 81-GRM1555C1H102JA1D; Supplier 3: Farnell; Supplier Part Number 3: *
C46 = CAP: SMD Capacitor; Manufacturer: Murata; Material: NP0; Tolerance: ±1%; Voltage: 50V; Type: Ceramic Capacitor; P/N: GRM1555C1H680FA01D; Supplier 1: Digi-key; Supplier Part Number 1: 490-8219-1-ND; Supplier 2: Mouser; Supplier Part Number 2: 81-GRM1555C1H680FA1D; Supplier 3: Farnell; Supplier Part Number 3: *
C47 = CAP: SMD Capacitor; Manufacturer: Murata; Material: NP0; Tolerance: ±5%; Voltage: 50V; Type: Ceramic Capacitor; P/N: GRM1885C1H122JA01D; Supplier 1: Digi-key; Supplier Part Number 1: 490-1453-1-ND; Supplier 2: Mouser; Supplier Part Number 2: 81-GRM1885C1H122JA01; Supplier 3: Farnell; Supplier Part Number 3: *
C50 = CAP: SMD Capacitor; Manufacturer: Murata; Material: NP0; Tolerance: ±0.05pF; Voltage: 50V; Type: Ceramic Capacitor; P/N: GRM1555C1HR30WA01D; Supplier 1: Digi-key; Supplier Part Number 1: 490-6261-1-ND; Supplier 2: Mouser; Supplier Part Number 2: 81-GRM1555C1HR30WA1D; Supplier 3: Farnell; Supplier Part Number 3: *
C53 C73 = CAP: as C102 on sheet DBoard_conn; Supplier 1: Digi-key; Supplier Part Number 1: 490-1312-1-ND; Supplier 2: Mouser; Supplier Part Number 2: 81-GRM36X103K25; Supplier 3: Farnell; Supplier Part Number 3: *
C54 C68 = CAP: SMD Capacitor; Manufacturer: Murata; Material: X7R; Tolerance: 10%; Voltage: 10V; Type: Ceramic Capacitor; P/N: GRM188R71A225KE15J; Supplier 1: Digi-key; Supplier Part Number 1: 490-6418-1-ND; Supplier 2: Mouser; Supplier Part Number 2: 81-GRM188R71A225KE5J; Supplier 3: Farnell; Supplier Part Number 3: *
C56 C70 = CAP: SMD Capacitor; Manufacturer: Kemet; Material: NP0; Tolerance: 1%; Voltage: 50V; Type: Ceramic Capacitor; P/N: C0603C222F5GACTU; Supplier 1: Digi-key; Supplier Part Number 1: 399-14502-1-ND; Supplier 2: Mouser; Supplier Part Number 2: 80-C0603C222F5G; Supplier 3: Farnell; Supplier Part Number 3: *
C57 C71 = CAP: SMD Capacitor; Manufacturer: KYOCERA AVX; Material: X7R; Tolerance: ±5%; Voltage: 50V; Type: Ceramic Capacitor; P/N: 06035C273J4Z2A; Supplier 1: Digi-key; Supplier Part Number 1: 478-KAF15AR71H273JTCT-ND; Supplier 2: Mouser; Supplier Part Number 2: 581-06035C273J4Z2A; Supplier 3: Farnell; Supplier Part Number 3: *
C72 = CAP: SMD Capacitor; Manufacturer: Murata; Material: NP0; Tolerance: 1%; Voltage: 50V; Type: Ceramic Capacitor; P/N: GRM1555C1H100FA01D; Supplier 1: Digi-key; Supplier Part Number 1: 490-6186-1-ND; Supplier 2: Mouser; Supplier Part Number 2: 81-GRM1555C1H100FA1D; Supplier 3: Farnell; Supplier Part Number 3: *
D6 D8 = PE42553: HaRPTM technology-enhanced absorptive SPDT; Manufacturer: Peregrine Technical Solutions; P/N: PE42553A-Z; Type: SPDT RF Switch; Name: PE42553; Package: 16-lead 3 × 3 mm QFN; Supplier 1: Digi-Key; Supplier Part Number 1: 1046-1137-1-ND; Supplier 2: Mouser; Supplier Part Number 2: 81-PE42553B-Z; Supplier 3: Farnell; Supplier Part Number 3: *
D7 = SIM-43MH+: Frequency Mixer; Manufacturer: Mini-Circuits; Power Level: +13dBm; Name: SIM-43MH+; Package: HV1195; Type: Frequency Mixer; P/N: SIM-43MH+; Supplier 1: Digi-key; Supplier Part Number 1: *; Supplier 2: Mouser; Supplier Part Number 2: 139-SIM-43MH; Supplier 3: Minicircuits; Supplier Part Number 3: SIM-43MH+
D9 = PE42562: The PE42582 is a HaRP™ technology-enhanced absorptive SP6T RF switch; Manufacturer: Peregrine Technical Solutions; P/N: PE42562A-X; Name: PE42562; Package: 24-lead 4 × 4 × 0.85 mm QFN; Type: Absorptive SP6T RF switch; Supplier 1: Digi-key; Supplier Part Number 1: *; Supplier 2: Mouser; Supplier Part Number 2: 81-PE42562A-X; Supplier 3: Farnell; Supplier Part Number 3: *
D10 = ADL5375: Broadband Quadrature Modulator; Manufacturer: Analog Devices; Voltage: 4.75 V to 5.25 V; P/N: ADL5375-05SCPZEPR7; Package: 24-lead LFCSP_VQ package; Temperature Range: –40°C to 125°C; Type: Broadband Quadrature Modulator; Supplier 1: Digi-key; Supplier Part Number 1: ADL5375-05ACPZ-R7CT-ND; Supplier 2: Mouser; Supplier Part Number 2: 584-ADL5375-05ACPZR7; Supplier 3: Farnell; Supplier Part Number 3: *
D11 = ADL5611: RF/IF Gain Block; Manufacturer: Analog Devices; P/N: ADL5611ARKZ-R7; Name: ADL5611; Package: SOT89; Type: RF/IF Gain Block; Supplier 1: Digi-Key; Supplier Part Number 1: 505-ADL5611ARKZ-R7CT-ND; Supplier 2: Mouser; Supplier Part Number 2: 584-ADL5611ARKZ-R7; Supplier 3: Farnell; Supplier Part Number 3: *
D12 D13 = LTC6948: The LTC®LTC6948 is a high performance, low noise, 6.39GHz  phase-locked loop (PLL); Manufacturer: Linear Technology; Voltage: 3.15 V ~ 5.25 V; Type: Clock/Frequency Synthesizer (RF/IF), Integer N; P/N: LTC6948IUFD-4; Package: 28-QFN (4x5); Temperature Range: -40°C ~ 105°C; Supplier 1: Digi-Key; Supplier Part Number 1: 505-LTC6948IUFD-4#PBF-ND; Name: LTC6948-4; Supplier 2: Mouser; Supplier Part Number 2: 584-LTC6948IUFD-4PBF; Supplier 3: Farnell; Supplier Part Number 3: *
L7-L14 = Inductor RF: Chip SMD Inductor; Manufacturer: Coilcraft; Current: 680mA; Frequency: 2.70GHz; Name: 0603HP-33NXGE; Series: 0603HP; Temperature Range: -25…85°C; P/N: 0603HP-33NXGE; Supplier 1: Digi-key; Supplier Part Number 1: *; Supplier 2: Mouser; Supplier Part Number 2: 994-0603HP-33NXGLW; Supplier 3: Farnell; Supplier Part Number 3: 2286156
L15 = Inductor RF: Chip SMD Inductor; Manufacturer: Coilcraft; Current: 810mA; Frequency: 2.45GHz; Name: 0603HP-43NXJE; Tolerance: 5%; Series: 0603HP; Temperature Range: -25…85°C; P/N: 0603HP-43NXJE; Supplier 1: Digi-key; Supplier Part Number 1: *; Supplier 2: Mouser; Supplier Part Number 2: 994-0603HP-43NXJLW; Supplier 3: Farnell; Supplier Part Number 3: *
L16 L17 = Inductor RF: Chip SMD Inductor; Manufacturer: Coilcraft; Current: 600mA; Frequency: 2.00GHz; Name: 0603HP-68NXJE; Tolerance: 5%; Series: 0603HP; Temperature Range: -25…85°C; P/N: 0603HP-68NXJE; Supplier 1: Digi-key; Supplier Part Number 1: *; Supplier 2: Mouser; Supplier Part Number 2: 994-0603HP-68NXJLW; Supplier 3: Farnell; Supplier Part Number 3: 2286224
R13 R14 R16 R17 R19 R20 R24 R27 = RES: SMD Resistor; Manufacturer: Panasonic Electronic Components; Name: Chip SMD Resistor; Power: 0.063 Wt; P/N: ERJ-2RKD49R9X; Temperature Range: -55…155°C; Supplier 1: Digi-key; Supplier Part Number 1: P15987CT-ND; Supplier 2: Mouser; Supplier Part Number 2: 667-ERJ-2RKD49R9X; Supplier 3: Farnell; Supplier Part Number 3: *
R15 R18 = RES: SMD Resistor; Manufacturer: Panasonic Electronic Components; Name: Chip SMD Resistor; Power: 0.1 Wt; P/N: ERJ-2RKF1400X; Temperature Range: -55…155°C; Supplier 1: Digi-key; Supplier Part Number 1: P140LCT-ND; Supplier 2: Mouser; Supplier Part Number 2: 667-ERJ-2RKF1400X; Supplier 3: Farnell; Supplier Part Number 3: *
R21 R23 = RES: SMD Resistor; Manufacturer: Panasonic Electronic Components; Name: Chip SMD Resistor; Power: 0.1 Wt; Tolerance: ±1%; P/N: ERJ-2RKF2200X; Temperature Range: -55…155°C; Supplier 1: Digi-key; Supplier Part Number 1: *; Supplier 2: Mouser; Supplier Part Number 2: 667-ERJ-2RKF2200X; Supplier 3: Farnell; Supplier Part Number 3: 2302563
R22 = RES: SMD Resistor; Manufacturer: Vishay; Name: Chip SMD Resistor; Power: 0.063 Wt; Tolerance: ±1%; P/N: CRCW040224R0FKED; Temperature Range: -55…155°C; Supplier 1: Digi-key; Supplier Part Number 1: 541-24.0LCT-ND; Supplier 2: Mouser; Supplier Part Number 2: 71-CRCW040224R0FKED; Supplier 3: Farnell; Supplier Part Number 3: *
R25 R28 = RES: SMD Resistor; Manufacturer: Panasonic Electronic Components; Name: Chip SMD Resistor; Power: 0.1 Wt; P/N: ERA-3AEB3320V; Temperature Range: -55…155°C; Supplier 1: Digi-key; Supplier Part Number 1: P332DBCT-ND; Supplier 2: Mouser; Supplier Part Number 2: 667-ERA-3AEB3320V; Supplier 3: Farnell; Supplier Part Number 3: *
T1 = TCM2-452X-2+: RF Transformer; Manufacturer: Mini-Circuits; Name: TCM2-452X-2+; P/N: TCM2-452X-2+; Type: RF Transformer; Package: DB1627; Supplier 1: Digi-key; Supplier Part Number 1: *; Supplier 2: Mouser; Supplier Part Number 2: *; Supplier 3: Minicircuits; Supplier Part Number 3: TCM2-452X-2+
T2 T3 = TC2-1TX+: RF Transformer; Manufacturer: Mini-Circuits; Name: TC2-1TX+; P/N: TC2-1TX+; Type: RF Transformer; Package: AT1521; Supplier 1: Digi-key; Supplier Part Number 1: 3157-TC2-1TX+CT-ND; Supplier 2: Mouser; Supplier Part Number 2: 139-TC2-1TX; Supplier 3: Farnell; Supplier Part Number 3: *
Z3 = LDPW-162-242+: Diplexer; Manufacturer: Mini-Circuits; Frequency: DC to 6000 MHz; Name: LDPW-162-242+; P/N: LDPW-162-242+; Type: Diplexer; Package: JC0603C; Supplier 1: Digi-key; Supplier Part Number 1: 3157-LDPW-162-242+CT-ND; Supplier 2: Mouser; Supplier Part Number 2: 139-LDPW-162-242; Supplier 3: Farnell; Supplier Part Number 3: *
Z4 = LDPG-212-322+: Diplexer; Manufacturer: Mini-Circuits; Frequency: DC to 5000 MHz; Name: LDPG-212-322+; P/N: LDPG-212-322+; Type: Diplexer; Package: GE0805C-10; Supplier 1: Digi-key; Supplier Part Number 1: *; Supplier 2: Mouser; Supplier Part Number 2: *; Supplier 3: Minicircuits; Supplier Part Number 3: LDPG-212-322+
Z5 = LFCG-92+: Low Pass Filter; Manufacturer: Mini-Circuits; Name: LFCG-92+; P/N: LFCG-92+; Type: Low Pass Filter; Package: GE0805C-2; Supplier 1: Digi-key; Supplier Part Number 1: 3157-LFCG-92+CT-ND; Supplier 2: Mouser; Supplier Part Number 2: 139-LFCG-92; Supplier 3: Farnell; Supplier Part Number 3: *

## Sheet TX.SchDoc: {Наименование}
size 420 x 297 mm; DocumentNumber: ПЛАС.ХХХХХХ.ХХХ ХХ; SheetNumber: {}; SheetTotal: {}; PageSetup: Record=PageOptions|CenterHorizontal=False|CenterVertical=False|PrintScale=0.95|XCorrection=0.00|YCorrection=0.00|PrintKind=1|BorderSize=5000000|LeftOffset=0|BottomOffset=0|Orientation=1|PaperLength=1000|PaperWidth=1000|Scale=100|PaperSource=15|PrintQuality=600|MediaType=1|DitherType=10|PaperKind=A4|PrintScaleMode=1; Rule: PcbType=ProtelPcb
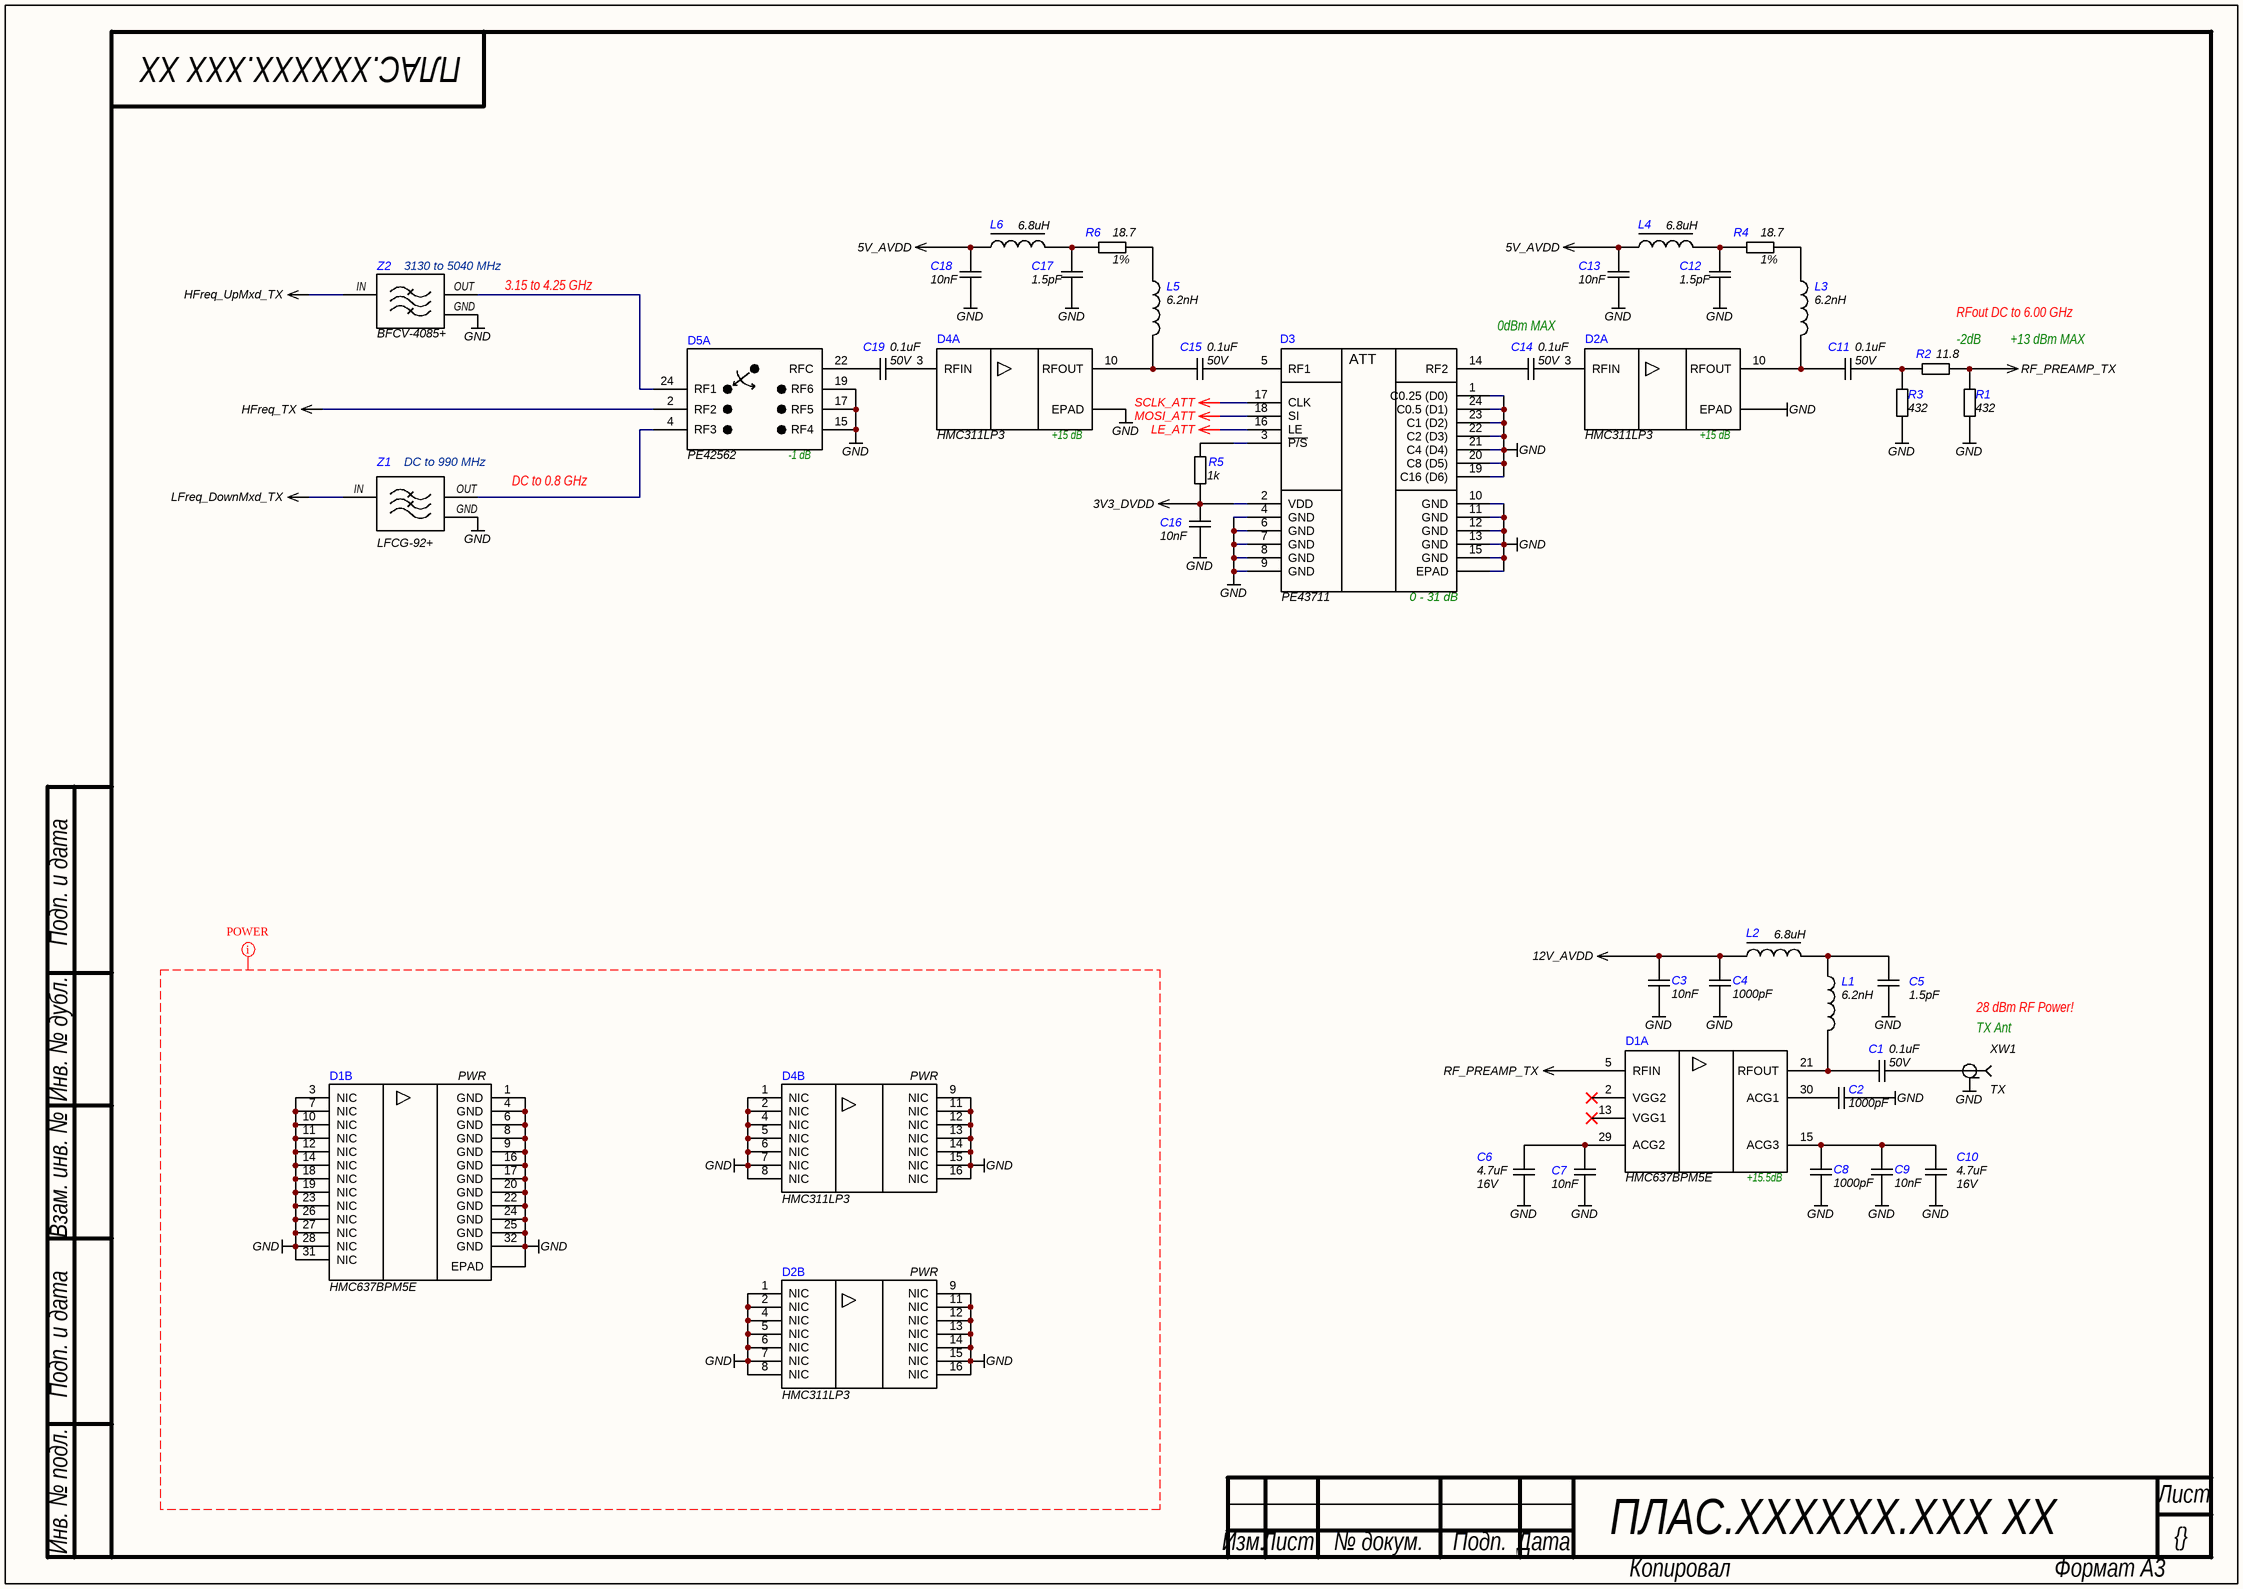
[diagram p3: TX.SchDoc]

### Parts
C1  value 0.1uF  Voltage: 50V  [C1206]  (hidden comment: CAP)
C2  value 1000pF  [C0402]  (hidden comment: CAP)
C3  value 10nF  [C0402]  (hidden comment: CAP)
C4  value 1000pF  [C0402]  (hidden comment: CAP)
C5  value 1.5pF  [C0402]  (hidden comment: CAP)
C6  value 4.7uF  Voltage: 16V  [C0603]  (hidden comment: CAP)
C7  value 10nF  [C0402]  (hidden comment: CAP)
C8  value 1000pF  [C0402]  (hidden comment: CAP)
C9  value 10nF  [C0402]  (hidden comment: CAP)
C10  value 4.7uF  Voltage: 16V  [C0603]  (hidden comment: CAP)
C11  value 0.1uF  Voltage: 50V  [C1206]  (hidden comment: CAP)
C12  value 1.5pF  [C0402]  (hidden comment: CAP)
C13  value 10nF  [C0402]  (hidden comment: CAP)
C14  value 0.1uF  Voltage: 50V  [C1206]  (hidden comment: CAP)
C15  value 0.1uF  Voltage: 50V  [C1206]  (hidden comment: CAP)
C16  value 10nF  [C0402]  (hidden comment: CAP)
C17  value 1.5pF  [C0402]  (hidden comment: CAP)
C18  value 10nF  [C0402]  (hidden comment: CAP)
C19  value 0.1uF  Voltage: 50V  [C1206]  (hidden comment: CAP)
D1  HMC637BPM5E  [LFCSP-32]  (parts A,B of 2)
D2  HMC311LP3  [QFN-16 v2]  (parts A,B of 2)
D3  PE43711  [QFN-24]
D4  HMC311LP3  [QFN-16 v2]  (parts A,B of 2)
D5  PE42562  [QFN-24]  (part A of 2)
L1  value 6.2nH  [L0805_HP]  (hidden comment: Inductor RF)
L2  value 6.8uH  [XFL3012]  (hidden comment: Inductor)
L3  value 6.2nH  [L0805_HP]  (hidden comment: Inductor RF)
L4  value 6.8uH  [XFL3012]  (hidden comment: Inductor)
L5  value 6.2nH  [L0805_HP]  (hidden comment: Inductor RF)
L6  value 6.8uH  [XFL3012]  (hidden comment: Inductor)
R1  value 432  [R0402]  (hidden comment: RES)
R2  value 11.8  [R0402]  (hidden comment: RES)
R3  value 432  [R0402]  (hidden comment: RES)
R4  value 18.7  Tolerance: 1%  [R0805]  (hidden comment: RES)
R5  value 1k  [R0402]  (hidden comment: RES)
R6  value 18.7  Tolerance: 1%  [R0805]  (hidden comment: RES)
XW1  TX  [MOLEX SD-73251-135 (Gold)]
Z1  LFCG-92+  Frequency: DC to 990 MHz  [GE0805C-2]
Z2  BFCV-4085+  Frequency: 3130 to 5040 MHz  [JV1210C]

### Nets
3V3_DVDD: C16.2 D3.2(VDD) R5.1
5V_AVDD: C13.2 C18.2 L4.1 L6.1
12V_AVDD: C3.2 C4.2 L2.1
GND: C2.2 C3.1 C4.1 C5.1 C6.2 C7.1 C8.1 C9.1 C10.2 C12.1 C13.1 C16.1 C17.1 C18.1 D1.0(EPAD) D1.1(GND) D1.3(NIC) D1.4(GND) D1.6(GND) D1.7(NIC) D1.8(GND) D1.9(GND) D1.10(NIC) D1.11(NIC) D1.12(NIC) D1.14(NIC) D1.16(GND) D1.17(GND) D1.18(NIC) D1.19(NIC) D1.20(GND) D1.22(GND) D1.23(NIC) D1.24(GND) D1.25(GND) D1.26(NIC) D1.27(NIC) D1.28(NIC) D1.31(NIC) D1.32(GND) D2.1(NIC) D2.2(NIC) D2.4(NIC) D2.5(NIC) D2.6(NIC) D2.7(NIC) D2.8(NIC) D2.9(NIC) D2.11(NIC) D2.12(NIC) D2.13(NIC) D2.14(NIC) D2.15(NIC) D2.16(NIC) D2.17(EPAD) D3.1(C0.25_(D0)) D3.4(GND) D3.6(GND) D3.7(GND) D3.8(GND) D3.9(GND) D3.10(GND) D3.11(GND) D3.12(GND) D3.13(GND) D3.15(GND) D3.19(C16_(D6)) D3.20(C8_(D5)) D3.21(C4_(D4)) D3.22(C2_(D3)) D3.23(C1_(D2)) D3.24(C0.5_(D1)) D3.25(EPAD) D4.1(NIC) D4.2(NIC) D4.4(NIC) D4.5(NIC) D4.6(NIC) D4.7(NIC) D4.8(NIC) D4.9(NIC) D4.11(NIC) D4.12(NIC) D4.13(NIC) D4.14(NIC) D4.15(NIC) D4.16(NIC) D4.17(EPAD) D5.15(RF4) D5.17(RF5) D5.19(RF6) R1.2 R3.2 XW1.G(GND) Z1.GND Z2.GND
HFreq_TX: D5.2(RF2)
HFreq_UpMxd_TX: Z2.IN
LE_ATT: D3.16(LE)
LFreq_DownMxd_TX: Z1.IN
MOSI_ATT: D3.18(SI)
RF_PREAMP_TX: D1.5(RFIN) R1.1 R2.1
SCLK_ATT: D3.17(CLK)
NetC1_1: C1.1 XW1.S(RF)
NetC1_2: C1.2 D1.21(RFOUT) L1.1
NetC2_1: C2.1 D1.30(ACG1)
NetC5_2: C5.2 L1.2 L2.2
NetC6_1: C6.1 C7.2 D1.29(ACG2)
NetC8_2: C8.2 C9.2 C10.1 D1.15(ACG3)
NetC11_1: C11.1 R2.2 R3.1
NetC11_2: C11.2 D2.10(RFOUT) L3.1
NetC12_2: C12.2 L4.2 R4.2
NetC14_1: C14.1 D2.3(RFIN)
NetC14_2: C14.2 D3.14(RF2)
NetC15_1: C15.1 D3.5(RF1)
NetC15_2: C15.2 D4.10(RFOUT) L5.1
NetC17_2: C17.2 L6.2 R6.2
NetC19_1: C19.1 D4.3(RFIN)
NetC19_2: C19.2 D5.22(RFC)
NetD3_3: D3.3(~{P/S}) R5.2
NetD5_4: D5.4(RF3) Z1.OUT
NetD5_24: D5.24(RF1) Z2.OUT
NetL3_2: L3.2 R4.1
NetL5_2: L5.2 R6.1

Not connected (* = marked no-connect by the designer): D1 2(VGG2)* 13(VGG1)*

### Layout directives
net class POWER: GND

### Notes on the sheet
- 3.15 to 4.25 GHz
- RFout DC to 6.00 GHz
- 0dBm MAX
- (near R2) -2dB
- +13 dBm MAX
- DC to 0.8 GHz
- (near XW1) TX Ant
- 28 dBm RF Power!
- Подп. и дата
- Инв. № дубл.
- Взам. инв. №
- Инв. № подл.
- Лист
- Изм.
- № докум.
- Подп.
- Дата
- Копировал
- Формат А3
- (in symbol HMC311LP3, part A) +15 dB
- (in symbol HMC311LP3, part B) PWR
- (in symbol HMC637BPM5E, part A) +15.5dB
- (in symbol HMC637BPM5E, part B) PWR
- (in symbol PE42562, part A) -1 dB
- (in symbol PE43711) ATT; 0 - 31 dB

### Library data of the parts
C1 C11 C14 C15 C19 = CAP: SMD Capacitor; Manufacturer: Murata; Material: NP0; Tolerance: 5%; Type: Ceramic Capacitor; P/N: GRM31C5C1H104JA01K; Supplier 1: Digi-key; Supplier Part Number 1: 490-8335-1-ND; Supplier 2: Mouser; Supplier Part Number 2: 81-GRM31C5C1H104JA1K; Supplier 3: Farnell; Supplier Part Number 3: *
C2 C4 C8 = CAP: as C45 on sheet IF_TX; Supplier 1: Digi-key; Supplier Part Number 1: 490-3244-1-ND; Supplier 2: Mouser; Supplier Part Number 2: 81-GRM1555C1H102JA1D; Supplier 3: Farnell; Supplier Part Number 3: *
C3 C7 C9 C13 C16 C18 = CAP: as C102 on sheet DBoard_conn; Supplier 1: Digi-key; Supplier Part Number 1: 490-1312-1-ND; Supplier 2: Mouser; Supplier Part Number 2: 81-GRM36X103K25; Supplier 3: Farnell; Supplier Part Number 3: *
C5 C12 C17 = CAP: SMD Capacitor; Manufacturer: Murata; Material: NP0; Tolerance: ±0.05pF; Voltage: 50V; Type: Ceramic Capacitor; P/N: GRM1555C1H1R5WA01D; Supplier 1: Digi-key; Supplier Part Number 1: 490-6213-1-ND; Supplier 2: Mouser; Supplier Part Number 2: 81-GRM1555C1H1R5WA1D; Supplier 3: Farnell; Supplier Part Number 3: *
C6 C10 = CAP: SMD Capacitor; Manufacturer: Samsung; Material: X5R; Tolerance: 10%; Type: Ceramic Capacitor; P/N: CL10A475KO8NNNC; Supplier 1: Digi-key; Supplier Part Number 1: 1276-1784-1-ND; Supplier 2: Mouser; Supplier Part Number 2: 187-CL10A475KO8NNNC; Supplier 3: Farnell; Supplier Part Number 3: 3013397
D1 = HMC637BPM5E: 1 W Power Amplifier; Manufacturer: Analog Devices; Voltage: 12 V at 345 mA typical; Package: 32-lead, 5 mm × 5 mm LFCSP; Temperature Range: -40°C ~ 105°C; Type: Power Amplifier; P/N: HMC637BPM5E; Name: HMC637BPM5E; Supplier 1: Digi-key; Supplier Part Number 1: 505-HMC637BPM5E-ND; Supplier 2: Mouser; Supplier Part Number 2: 584-HMC637BPM5E; Supplier 3: Farnell; Supplier Part Number 3: *
D2 D4 = HMC311LP3: InGaP HBT GAIN BLOCK; Manufacturer: Analog Devices; P/N: HMC311LP3E; Name: HMC311LP3; Package: 16 Lead 3x3mm SMT; Type: GAIN BLOCK; Supplier 1: Digi-key; Supplier Part Number 1: 1127-2929-ND; Supplier 2: Mouser; Supplier Part Number 2: 584-HMC311LP3E; Supplier 3: Farnell; Supplier Part Number 3: *
D3 = PE43711: The PE43711 is a 50Ω, HaRP™ technology-enhanced, 7-bit RF digital step attenuator; Manufacturer: Peregrine Technical Solutions; P/N: PE43711A-Z; Type: 7-bit RF digital step attenuator (DSA); Name: PE43711; Package: 24-lead 4 × 4 × 0.85 mm QFN; Supplier 1: Digi-Key; Supplier Part Number 1: 1046-1138-1-ND; Supplier 2: Mouser; Supplier Part Number 2: 81-PE43711B-Z; Supplier 3: Farnell; Supplier Part Number 3: *
D5 = PE42562: as D9 on sheet IF_TX; Name: PE42562; Package: 24-lead 4 × 4 × 0.85 mm QFN; Type: Absorptive SP6T RF switch; Supplier 1: Digi-key; Supplier Part Number 1: *; Supplier 2: Mouser; Supplier Part Number 2: 81-PE42562A-X; Supplier 3: Farnell; Supplier Part Number 3: *
L1 L3 L5 = Inductor RF: Chip SMD Inductor; Manufacturer: Coilcraft; Current: 1.5A; Frequency: 7200MHz; Name: 0805HP-6N2XJR; Tolerance: 5%; Series: 0805HP; Temperature Range: -25…85°C; P/N: 0805HP-6N2XJR; Supplier 1: Digi-key; Supplier Part Number 1: *; Supplier 2: Mouser; Supplier Part Number 2: 994-0805HP-6N2XJRC; Supplier 3: Farnell; Supplier Part Number 3: 0805HP-6N2XJRB
L2 L4 L6 = Inductor: Chip SMD Inductor; Manufacturer: Coilcraft; Current: 0.61A; Frequency: 39.9MHz; Name: XFL3012-682ME; Tolerance: ±5%; Series: XFL3012; Temperature Range: -25…85°C; P/N: XFL3012-682ME; Supplier 1: Digi-key; Supplier Part Number 1: 2457-XFL3012-682MEC-ND; Supplier 2: Mouser; Supplier Part Number 2: 994-XFL3012-682MEC; Supplier 3: Farnell; Supplier Part Number 3: *
R1 R3 = RES: SMD Resistor; Manufacturer: Panasonic Electronic Components; Name: Chip SMD Resistor; Power: 0.1 Wt; Tolerance: ±1%; P/N: ERJ-2RKF4320X; Temperature Range: -55…155°C; Supplier 1: Digi-key; Supplier Part Number 1: P432LCT-ND; Supplier 2: Mouser; Supplier Part Number 2: 667-ERJ-2RKF4320X; Supplier 3: Farnell; Supplier Part Number 3: *
R2 = RES: SMD Resistor; Manufacturer: Vishay; Name: Chip SMD Resistor; Power: 0.063 Wt; Tolerance: ±1%; P/N: CRCW040211R8FKED; Temperature Range: -55…155°C; Supplier 1: Digi-key; Supplier Part Number 1: 541-11.8LCT-ND; Supplier 2: Mouser; Supplier Part Number 2: 71-CRCW040211R8FKED; Supplier 3: Farnell; Supplier Part Number 3: *
R4 R6 = RES: SMD Resistor; Manufacturer: Panasonic Electronic Components; Name: Chip SMD Resistor; Power: 0.125 Wt; P/N: ERJ-6ENF18R7V; Temperature Range: -55…155°C; Supplier 1: Digi-key; Supplier Part Number 1: P18.7CCT-ND; Supplier 2: Mouser; Supplier Part Number 2: 667-ERJ-6ENF18R7V; Supplier 3: Farnell; Supplier Part Number 3: *
R5 = RES: SMD Resistor; Name: Chip SMD Resistor; Power: 0.062 Wt; Tolerance: 5%; P/N: ERJ-2GEJ102X; Temperature Range: -55…155°C; Supplier 1: Digi-key; Supplier Part Number 1: P1.0KJCT-ND; Supplier 2: Mouser; Supplier Part Number 2: 667-ERJ-2GEJ102X; Supplier 3: Farnell; Supplier Part Number 3: *
XW1 = RF Connector: 50 Ohms, SMA Jack, Vertica; Manufacturer: Molex; Impedance: 50Ω; P/N: 0732511352; Name: SMA Jack; Type: 50 Ohms, SMA Jack, Vertical, PCB SMT, Gold (Au) Body; Supplier 1: Digi-Key; Supplier Part Number 1: WM9458-ND; Supplier 2: Mouser; Supplier Part Number 2: 538-73251-1352; Supplier 3: Farnell; Supplier Part Number 3: *
Z1 = LFCG-92+: as Z5 on sheet IF_TX; Name: LFCG-92+; P/N: LFCG-92+; Type: Low Pass Filter; Package: GE0805C-2; Supplier 1: Digi-key; Supplier Part Number 1: 3157-LFCG-92+CT-ND; Supplier 2: Mouser; Supplier Part Number 2: 139-LFCG-92; Supplier 3: Farnell; Supplier Part Number 3: *
Z2 = BFCV-4085+: Bandpass Filter; Manufacturer: Mini-Circuits; Name: BFCV-4085+; P/N: BFCV-4085+; Type: Bandpass Filter; Package: JV1210C; Supplier 1: Digi-key; Supplier Part Number 1: 3157-BFCV-4085+CT-ND; Supplier 2: Mouser; Supplier Part Number 2: 139-BFCV-4085; Supplier 3: Farnell; Supplier Part Number 3: *

## Sheet REFCLK.SchDoc: {Наименование}
size 420 x 297 mm; DocumentNumber: ПЛАС.ХХХХХХ.ХХХ ХХ; SheetNumber: {}; SheetTotal: {}; PageSetup: Record=PageOptions|CenterHorizontal=False|CenterVertical=False|PrintScale=0.95|XCorrection=0.00|YCorrection=0.00|PrintKind=1|BorderSize=5000000|LeftOffset=0|BottomOffset=0|Orientation=1|PaperLength=1000|PaperWidth=1000|Scale=100|PaperSource=15|PrintQuality=600|MediaType=1|DitherType=10|PaperKind=A4|PrintScaleMode=1; Rule: PcbType=ProtelPcb
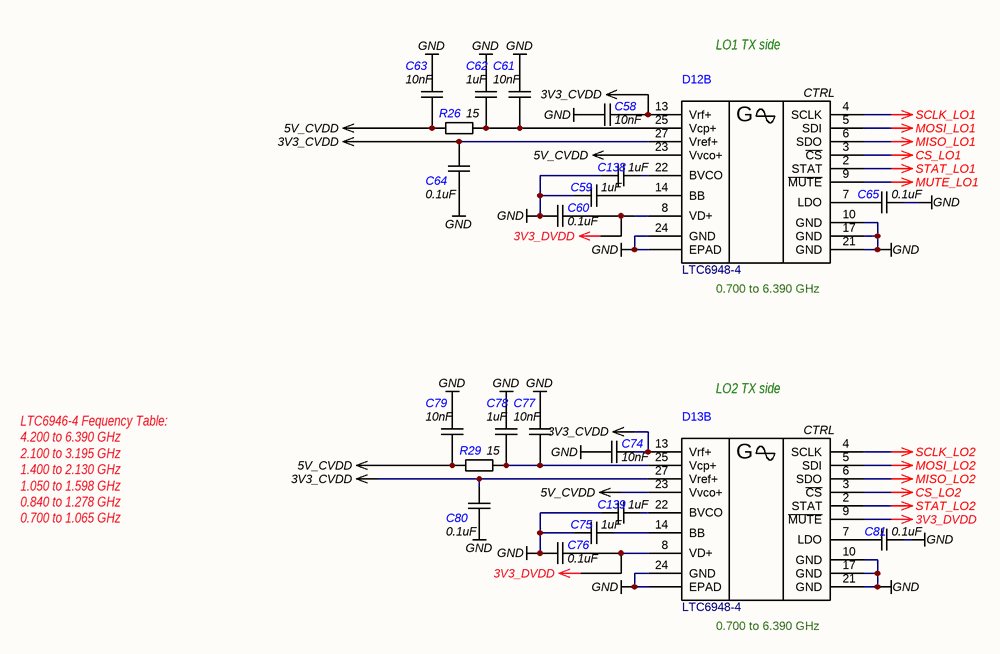
[diagram p4: REFCLK.SchDoc]

### Parts
C58  value 10nF  [C0402]  (hidden comment: CAP)
C59  value 1uF  [C0402]  (hidden comment: CAP)
C60  value 0.1uF  [C0402]  (hidden comment: CAP)
C61  value 10nF  [C0402]  (hidden comment: CAP)
C62  value 1uF  [C0402]  (hidden comment: CAP)
C63  value 10nF  [C0402]  (hidden comment: CAP)
C64  value 0.1uF  [C0402]  (hidden comment: CAP)
C65  value 0.1uF  [C0402]  (hidden comment: CAP)
C74  value 10nF  [C0402]  (hidden comment: CAP)
C75  value 1uF  [C0402]  (hidden comment: CAP)
C76  value 0.1uF  [C0402]  (hidden comment: CAP)
C77  value 10nF  [C0402]  (hidden comment: CAP)
C78  value 1uF  [C0402]  (hidden comment: CAP)
C79  value 10nF  [C0402]  (hidden comment: CAP)
C80  value 0.1uF  [C0402]  (hidden comment: CAP)
C81  value 0.1uF  [C0402]  (hidden comment: CAP)
C138  value 1uF  [C0402]  (hidden comment: CAP)
C139  value 1uF  [C0402]  (hidden comment: CAP)
D12  LTC6948-4  Frequency range: 0.700 to 6.390 GHz  [QFN-28]  (part B of 2)
D13  LTC6948-4  Frequency range: 0.700 to 6.390 GHz  [QFN-28]  (part B of 2)
R26  value 15  [R0603]  (hidden comment: RES)
R29  value 15  [R0603]  (hidden comment: RES)

### Nets
3V3_CVDD: C58.1 C64.2 C74.1 C80.2 D12.13(Vrf+) D12.27(Vref+) D13.13(Vrf+) D13.27(Vref+)
3V3_DVDD: C60.2 C76.2 D12.8(VD+) D13.8(VD+) D13.9(~{MUTE})
5V_CVDD: C63.2 C79.2 D12.23(Vvco+) D13.23(Vvco+) R26.2 R29.2
CS_LO1: D12.3(~{CS})
CS_LO2: D13.3(~{CS})
GND: C58.2 C59.1 C60.1 C61.1 C62.1 C63.1 C64.1 C65.1 C74.2 C75.1 C76.1 C77.1 C78.1 C79.1 C80.1 C81.1 C138.1 C139.1 D12.10(GND) D12.17(GND) D12.21(GND) D12.24(GND) D12.29(EPAD) D13.10(GND) D13.17(GND) D13.21(GND) D13.24(GND) D13.29(EPAD)
MISO_LO1: D12.6(SDO)
MISO_LO2: D13.6(SDO)
MOSI_LO1: D12.5(SDI)
MOSI_LO2: D13.5(SDI)
MUTE_LO1: D12.9(~{MUTE})
SCLK_LO1: D12.4(SCLK)
SCLK_LO2: D13.4(SCLK)
STAT_LO1: D12.2(STAT)
STAT_LO2: D13.2(STAT)
NetC59_2: C59.2 D12.14(BB)
NetC61_2: C61.2 C62.2 D12.25(Vcp+) R26.1
NetC65_2: C65.2 D12.7(LDO)
NetC75_2: C75.2 D13.14(BB)
NetC77_2: C77.2 C78.2 D13.25(Vcp+) R29.1
NetC81_2: C81.2 D13.7(LDO)
NetC138_2: C138.2 D12.22(BVCO)
NetC139_2: C139.2 D13.22(BVCO)

### Notes on the sheet
- LO1 TX side
- LO2 TX side
- LTC6946-4 Fequency Table:
  4.200 to 6.390 GHz
  2.100 to 3.195 GHz
  1.400 to 2.130 GHz
  1.050 to 1.598 GHz
  0.840 to 1.278 GHz
  0.700 to 1.065 GHz
- Подп. и дата
- Инв. № дубл.
- Взам. инв. №
- Инв. № подл.
- Лист
- Изм.
- № докум.
- Подп.
- Дата
- Копировал
- Формат А3
- (in symbol LTC6948, part B) CTRL; G

### Library data of the parts
C58 C61 C63 C74 C77 C79 = CAP: as C102 on sheet DBoard_conn; Supplier 1: Digi-key; Supplier Part Number 1: 490-1312-1-ND; Supplier 2: Mouser; Supplier Part Number 2: 81-GRM36X103K25; Supplier 3: Farnell; Supplier Part Number 3: *
C59 C62 C75 C78 C138 C139 = CAP: as C82 on sheet CPLD; Supplier 1: Digi-key; Supplier Part Number 1: 490-13339-1-ND; Supplier 2: Mouser; Supplier Part Number 2: 81-GRM155R70J105KA2J; Supplier 3: Farnell; Supplier Part Number 3: *
C60 C64 C65 C76 C80 C81 = CAP: as C83 on sheet CPLD; Supplier 1: Digi-key; Supplier Part Number 1: 490-6322-1-ND; Supplier 2: Mouser; Supplier Part Number 2: 81-GRM155R71A104KA1J; Supplier 3: Farnell; Supplier Part Number 3: *
D12 D13 = LTC6948: as D12 on sheet IF_TX; Package: 28-QFN (4x5); Temperature Range: -40°C ~ 105°C; Supplier 1: Digi-Key; Supplier Part Number 1: 505-LTC6948IUFD-4#PBF-ND; Name: LTC6948-4; Supplier 2: Mouser; Supplier Part Number 2: 584-LTC6948IUFD-4PBF; Supplier 3: Farnell; Supplier Part Number 3: *
R26 R29 = RES: SMD Resistor; Name: Chip SMD Resistor; Power: 0.1 Wt; Tolerance: 1%; P/N: ERJ-3EKF15R0V; Temperature Range: -55…155°C; Supplier 1: Digi-key; Supplier Part Number 1: P15.0HCT-ND; Supplier 2: Mouser; Supplier Part Number 2: 667-ERJ-3EKF15R0V; Supplier 3: Farnell; Supplier Part Number 3: *